# EAGLE design MGC3130_Board (EAGLE 6.3)

## Sheet 1 of 2
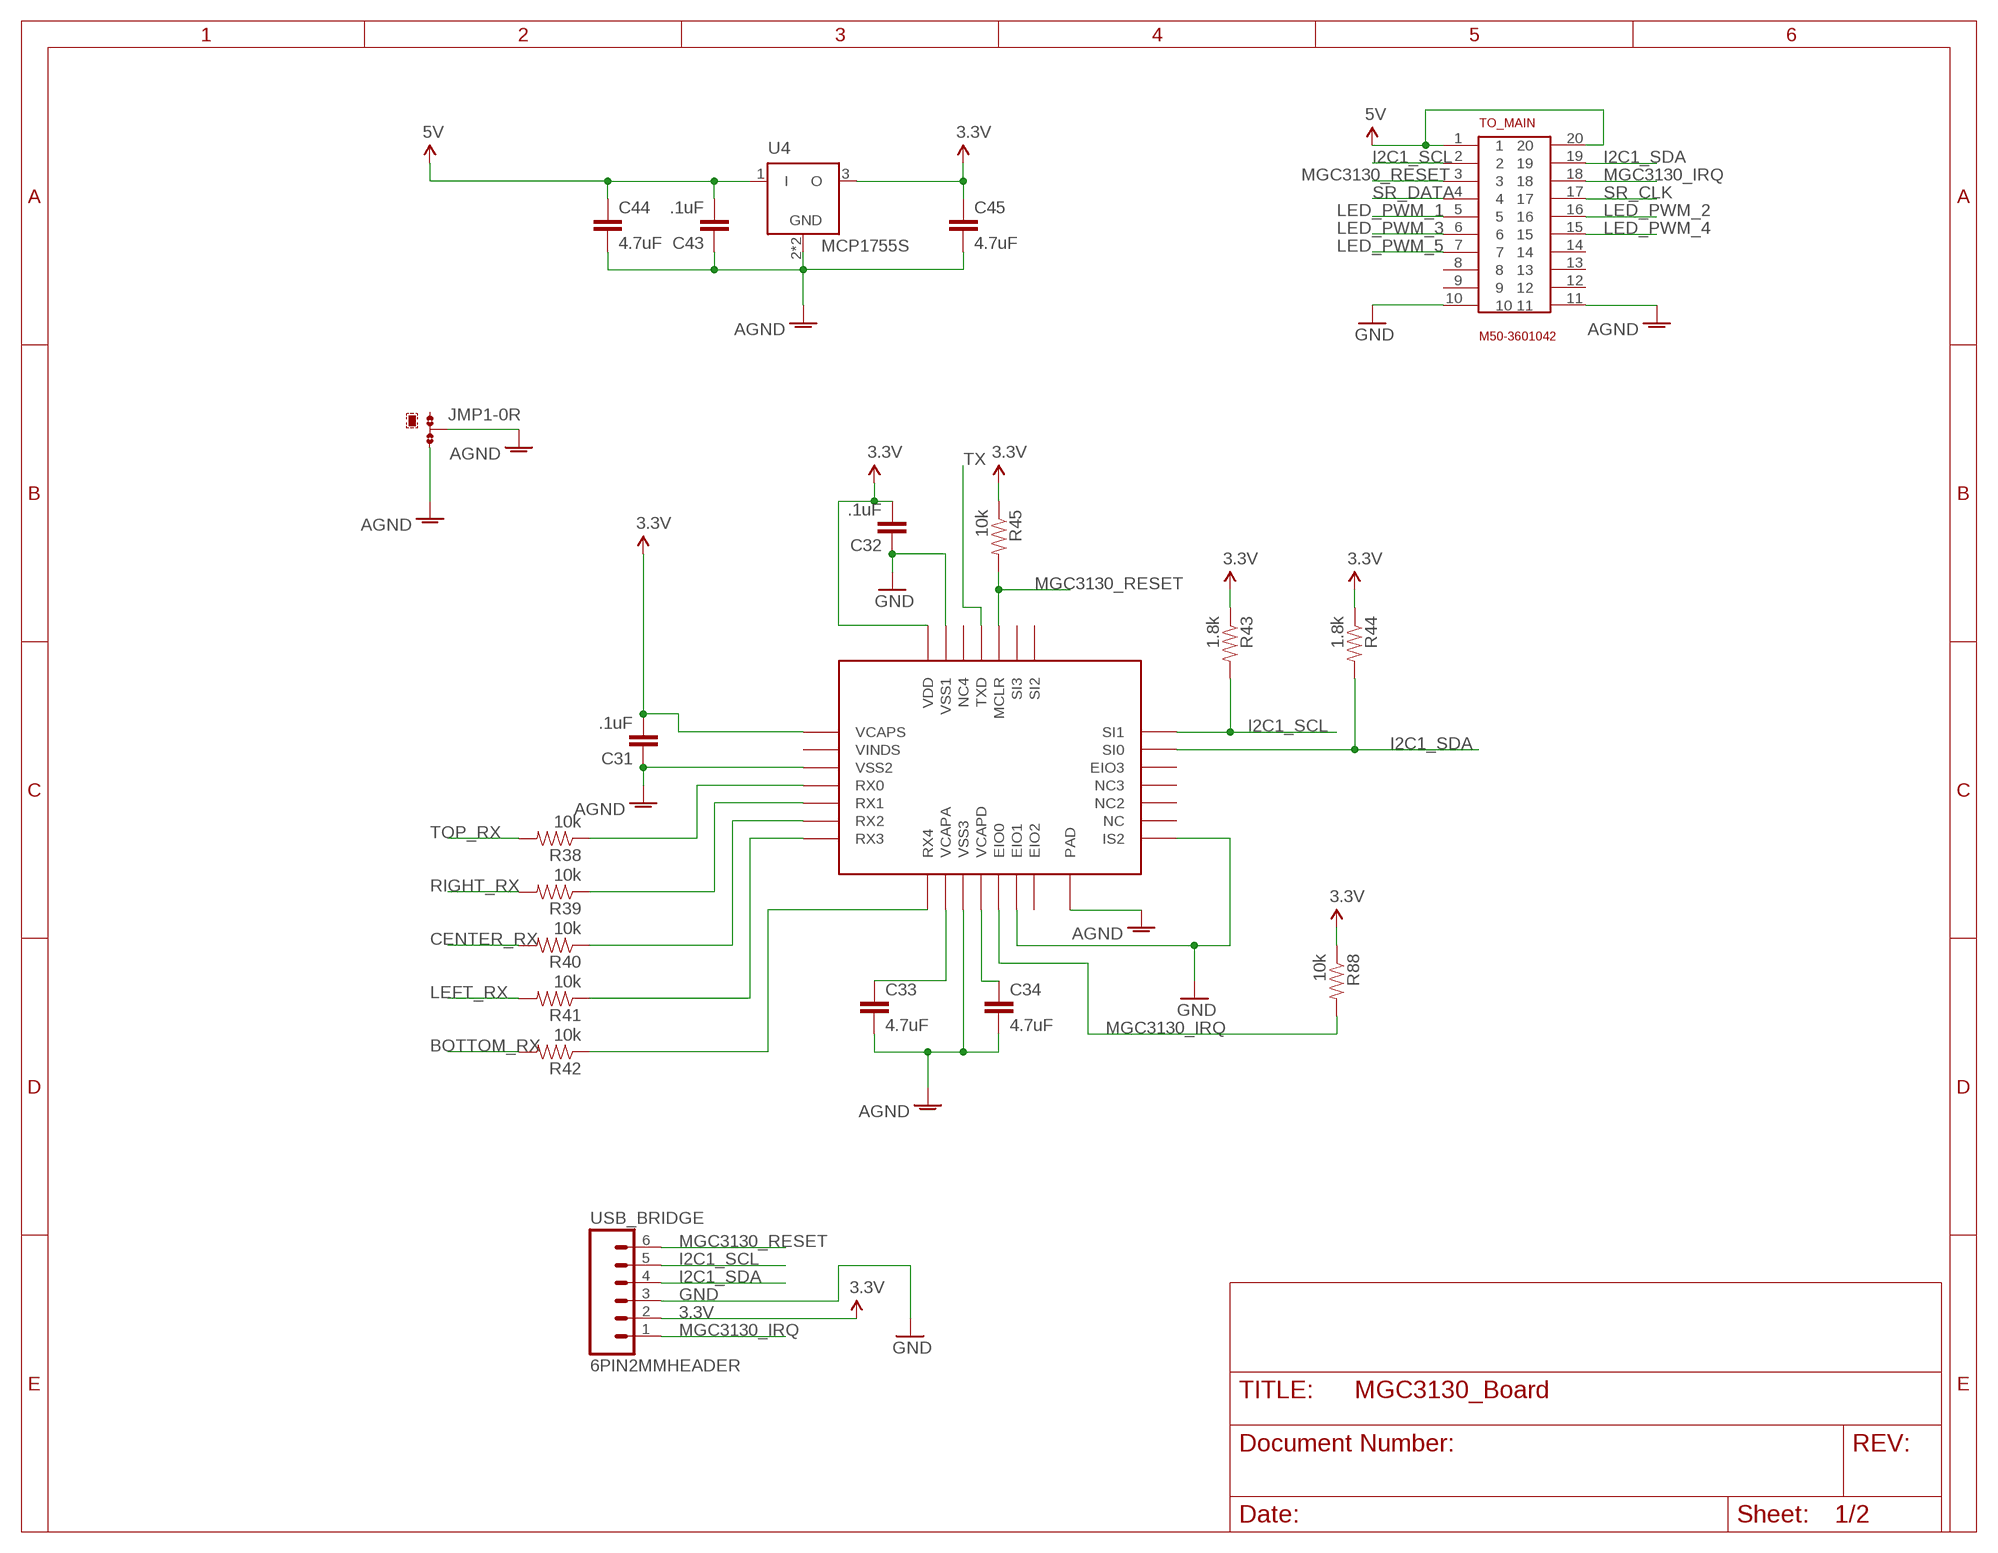
[diagram p0: schematic, sheet 1]

### Parts
C31  .1uF  CAP0603-CAP  [0603-CAP]
C32  .1uF  CAP0603-CAP  [0603-CAP]
C33  4.7uF  CAP1206  [1206]
C34  4.7uF  CAP1206  [1206]
C43  .1uF  CAP0603-CAP  [0603-CAP]
C44  4.7uF  CAP1206  [1206]
C45  4.7uF  CAP1206  [1206]
JMP1  0R-JUMPA  [A0R-JMP]
R38  10k  RESISTOR0603-RES  [0603-RES]
R39  10k  RESISTOR0603-RES  [0603-RES]
R40  10k  RESISTOR0603-RES  [0603-RES]
R41  10k  RESISTOR0603-RES  [0603-RES]
R42  10k  RESISTOR0603-RES  [0603-RES]
R43  1.8k  RESISTOR0603-RES  [0603-RES]
R44  1.8k  RESISTOR0603-RES  [0603-RES]
R45  10k  RESISTOR0603-RES  [0603-RES]
R88  10k  RESISTOR0603-RES  [0603-RES]
TO_MAIN  M50-3601042  [M50-3601042]
U4  MCP1755S  [SOT223]
U14  MGC3130  [QFN28]
USB_BRIDGE  6PIN2MMHEADER  [1X06_SMD_STRAIGHT]

### Nets
3.3V: C31.2 C32.2 C45.1 R43.1 R44.1 R45.1 R88.1 U4.3(O) U14.P$1(VCAPS) U14.P$28(VDD) USB_BRIDGE.2
5V: C43.2 C44.1 TO_MAIN.1 TO_MAIN.20 U4.1(I) ; also sheet 2
AGND: C31.1 C33.2 C34.2 C43.1 C44.2 C45.2 JMP1.2 JMP1.3 TO_MAIN.11 U4.2(GND) U4.4(GND) U14.P$3(VSS2) U14.P$10(VSS3) U14.P$29(PAD)
BOTTOM_RX: R42.2
CENTER_RX: R40.2
GND: C32.1 TO_MAIN.10 U14.P$13(EIO1) U14.P$15(IS2) U14.P$27(VSS1) USB_BRIDGE.3 ; also sheet 2
I2C1_SCL: R43.2 TO_MAIN.2 U14.P$21(SI1) USB_BRIDGE.5
I2C1_SDA: R44.2 TO_MAIN.19 U14.P$20(SI0) USB_BRIDGE.4
LED_PWM_1: TO_MAIN.5 ; also sheet 2
LED_PWM_2: TO_MAIN.16 ; also sheet 2
LED_PWM_3: TO_MAIN.6 ; also sheet 2
LED_PWM_4: TO_MAIN.15 ; also sheet 2
LED_PWM_5: TO_MAIN.7 ; also sheet 2
LEFT_RX: R41.2
MGC3130_IRQ: R88.2 TO_MAIN.18 U14.P$12(EIO0) USB_BRIDGE.1
MGC3130_RESET: R45.2 TO_MAIN.3 U14.P$24(MCLR) USB_BRIDGE.6
N$45: R38.1 U14.P$4(RX0)
N$46: R39.1 U14.P$5(RX1)
N$47: R40.1 U14.P$6(RX2)
N$48: R41.1 U14.P$7(RX3)
N$49: R42.1 U14.P$8(RX4)
N$50: C33.1 U14.P$9(VCAPA)
N$52: C34.1 U14.P$11(VCAPD)
RIGHT_RX: R39.2
SR_CLK: TO_MAIN.17 ; also sheet 2
SR_DATA: TO_MAIN.4 ; also sheet 2
TOP_RX: R38.2
TX: U14.P$25(TXD)
Unconnected: JMP1.1 TO_MAIN.8 TO_MAIN.9 TO_MAIN.12 TO_MAIN.13 TO_MAIN.14 U14.P$2(VINDS) U14.P$14(EIO2) U14.P$16(NC) U14.P$17(NC2) U14.P$18(NC3) U14.P$19(EIO3) U14.P$22(SI2) U14.P$23(SI3) U14.P$26(NC4)

## Sheet 2 of 2
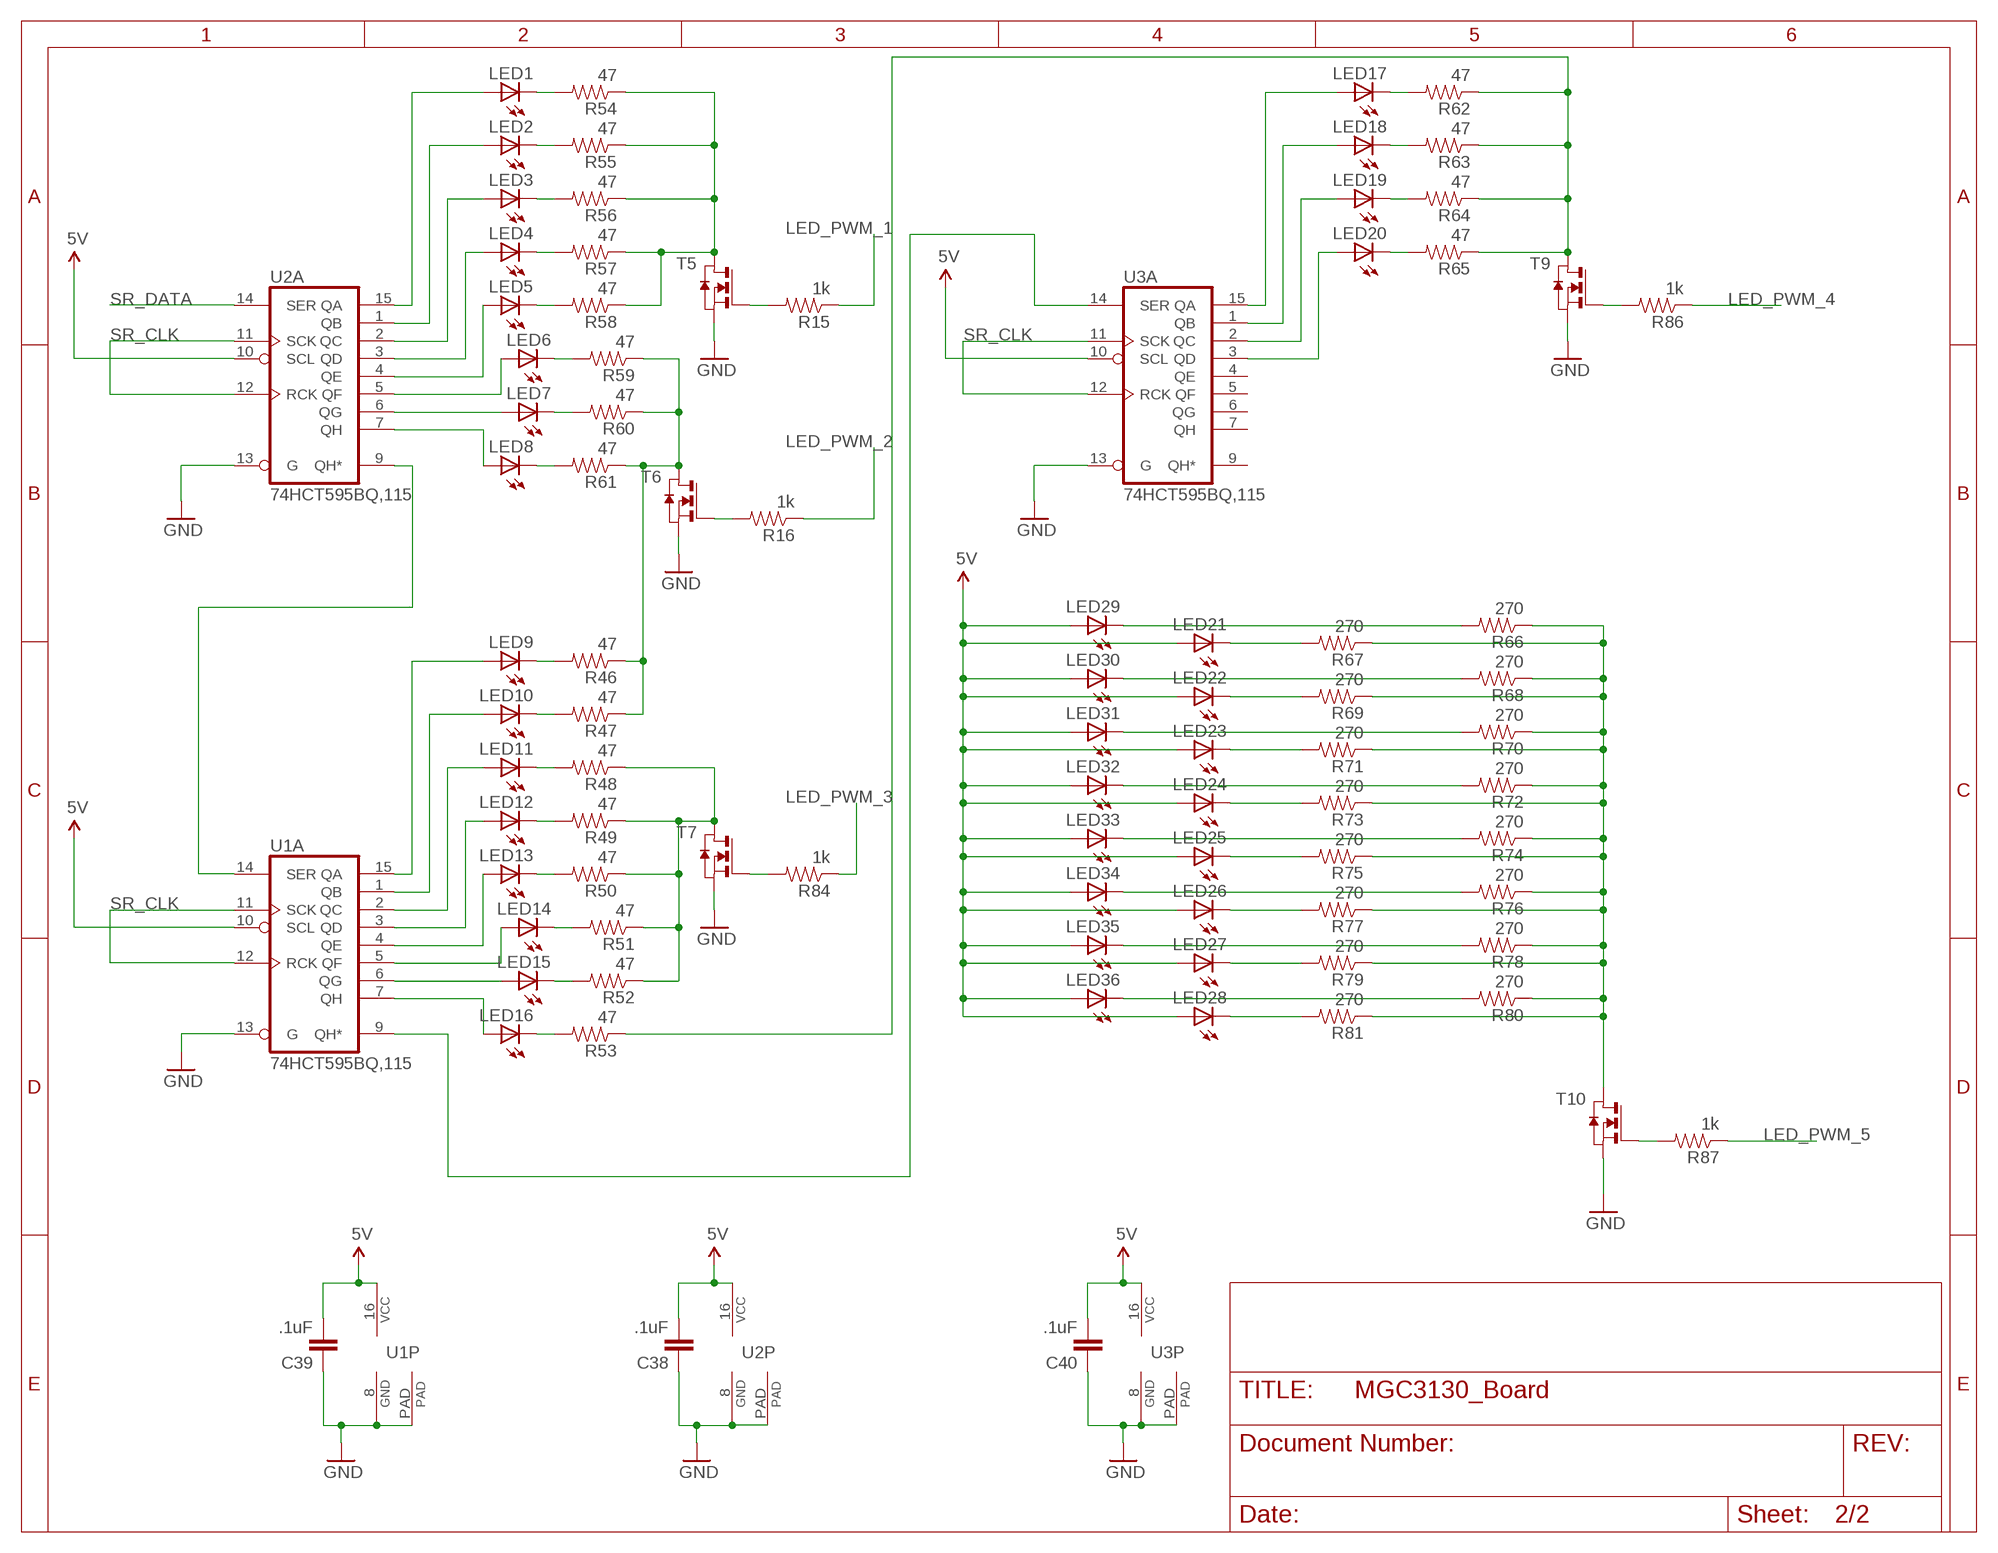
[diagram p1: schematic, sheet 2]

### Parts
C38  .1uF  CAP0603-CAP  [0603-CAP]
C39  .1uF  CAP0603-CAP  [0603-CAP]
C40  .1uF  CAP0603-CAP  [0603-CAP]
LED1  APA3010QBC/D-GX  [APA3010]
LED2  APA3010QBC/D-GX  [APA3010]
LED3  APA3010QBC/D-GX  [APA3010]
LED4  APA3010QBC/D-GX  [APA3010]
LED5  APA3010QBC/D-GX  [APA3010]
LED6  APA3010QBC/D-GX  [APA3010]
LED7  APA3010QBC/D-GX  [APA3010]
LED8  APA3010QBC/D-GX  [APA3010]
LED9  APA3010QBC/D-GX  [APA3010]
LED10  APA3010QBC/D-GX  [APA3010]
LED11  APA3010QBC/D-GX  [APA3010]
LED12  APA3010QBC/D-GX  [APA3010]
LED13  APA3010QBC/D-GX  [APA3010]
LED14  APA3010QBC/D-GX  [APA3010]
LED15  APA3010QBC/D-GX  [APA3010]
LED16  APA3010QBC/D-GX  [APA3010]
LED17  APA3010QBC/D-GX  [APA3010]
LED18  APA3010QBC/D-GX  [APA3010]
LED19  APA3010QBC/D-GX  [APA3010]
LED20  APA3010QBC/D-GX  [APA3010]
LED21  APA3010SRCPRV-GX  [APA3010]
LED22  APA3010SRCPRV-GX  [APA3010]
LED23  APA3010SRCPRV-GX  [APA3010]
LED24  APA3010SRCPRV-GX  [APA3010]
LED25  APA3010SRCPRV-GX  [APA3010]
LED26  APA3010SRCPRV-GX  [APA3010]
LED27  APA3010SRCPRV-GX  [APA3010]
LED28  APA3010SRCPRV-GX  [APA3010]
LED29  APA3010SRCPRV-GX  [APA3010]
LED30  APA3010SRCPRV-GX  [APA3010]
LED31  APA3010SRCPRV-GX  [APA3010]
LED32  APA3010SRCPRV-GX  [APA3010]
LED33  APA3010SRCPRV-GX  [APA3010]
LED34  APA3010SRCPRV-GX  [APA3010]
LED35  APA3010SRCPRV-GX  [APA3010]
LED36  APA3010SRCPRV-GX  [APA3010]
R15  1k  RESISTOR0603-RES  [0603-RES]
R16  1k  RESISTOR0603-RES  [0603-RES]
R46  47  RESISTOR0603-RES  [0603-RES]
R47  47  RESISTOR0603-RES  [0603-RES]
R48  47  RESISTOR0603-RES  [0603-RES]
R49  47  RESISTOR0603-RES  [0603-RES]
R50  47  RESISTOR0603-RES  [0603-RES]
R51  47  RESISTOR0603-RES  [0603-RES]
R52  47  RESISTOR0603-RES  [0603-RES]
R53  47  RESISTOR0603-RES  [0603-RES]
R54  47  RESISTOR0603-RES  [0603-RES]
R55  47  RESISTOR0603-RES  [0603-RES]
R56  47  RESISTOR0603-RES  [0603-RES]
R57  47  RESISTOR0603-RES  [0603-RES]
R58  47  RESISTOR0603-RES  [0603-RES]
R59  47  RESISTOR0603-RES  [0603-RES]
R60  47  RESISTOR0603-RES  [0603-RES]
R61  47  RESISTOR0603-RES  [0603-RES]
R62  47  RESISTOR0603-RES  [0603-RES]
R63  47  RESISTOR0603-RES  [0603-RES]
R64  47  RESISTOR0603-RES  [0603-RES]
R65  47  RESISTOR0603-RES  [0603-RES]
R66  270  RESISTOR0603-RES  [0603-RES]
R67  270  RESISTOR0603-RES  [0603-RES]
R68  270  RESISTOR0603-RES  [0603-RES]
R69  270  RESISTOR0603-RES  [0603-RES]
R70  270  RESISTOR0603-RES  [0603-RES]
R71  270  RESISTOR0603-RES  [0603-RES]
R72  270  RESISTOR0603-RES  [0603-RES]
R73  270  RESISTOR0603-RES  [0603-RES]
R74  270  RESISTOR0603-RES  [0603-RES]
R75  270  RESISTOR0603-RES  [0603-RES]
R76  270  RESISTOR0603-RES  [0603-RES]
R77  270  RESISTOR0603-RES  [0603-RES]
R78  270  RESISTOR0603-RES  [0603-RES]
R79  270  RESISTOR0603-RES  [0603-RES]
R80  270  RESISTOR0603-RES  [0603-RES]
R81  270  RESISTOR0603-RES  [0603-RES]
R84  1k  RESISTOR0603-RES  [0603-RES]
R86  1k  RESISTOR0603-RES  [0603-RES]
R87  1k  RESISTOR0603-RES  [0603-RES]
T5  NMOSSOT23  [SOT-23]
T6  NMOSSOT23  [SOT-23]
T7  NMOSSOT23  [SOT-23]
T9  NMOSSOT23  [SOT-23]
T10  NMOSSOT23  [SOT-23]
U1  74HCT595BQ,115  [DHVQFN16]
U2  74HCT595BQ,115  [DHVQFN16]
U3  74HCT595BQ,115  [DHVQFN16]

### Nets
5V: C38.2 C39.2 C40.2 LED21.P$2(A) LED22.P$2(A) LED23.P$2(A) LED24.P$2(A) LED25.P$2(A) LED26.P$2(A) LED27.P$2(A) LED28.P$2(A) LED29.P$2(A) LED30.P$2(A) LED31.P$2(A) LED32.P$2(A) LED33.P$2(A) LED34.P$2(A) LED35.P$2(A) LED36.P$2(A) U1.10(A:SCL) U1.16(P:VCC) U2.10(A:SCL) U2.16(P:VCC) U3.10(A:SCL) U3.16(P:VCC) ; also sheet 1
GND: C38.1 C39.1 C40.1 T5.2(S) T6.2(S) T7.2(S) T9.2(S) T10.2(S) U1.8(P:GND) U1.13(A:G) U1.PAD(P:GND1) U2.8(P:GND) U2.13(A:G) U2.PAD(P:GND1) U3.8(P:GND) U3.13(A:G) U3.PAD(P:GND1) ; also sheet 1
LED_PWM_1: R15.1 ; also sheet 1
LED_PWM_2: R16.1 ; also sheet 1
LED_PWM_3: R84.1 ; also sheet 1
LED_PWM_4: R86.1 ; also sheet 1
LED_PWM_5: R87.1 ; also sheet 1
N$1: LED29.P$1(C) R66.2
N$2: LED21.P$1(C) R67.2
N$3: LED30.P$1(C) R68.2
N$4: LED22.P$1(C) R69.2
N$5: LED31.P$1(C) R70.2
N$6: LED15.P$2(A) U1.6(A:QG)
N$8: LED23.P$1(C) R71.2
N$9: LED32.P$1(C) R72.2
N$10: LED24.P$1(C) R73.2
N$11: LED34.P$1(C) R76.2
N$12: LED33.P$1(C) R74.2
N$13: LED25.P$1(C) R75.2
N$14: LED26.P$1(C) R77.2
N$15: LED35.P$1(C) R78.2
N$16: LED27.P$1(C) R79.2
N$17: R15.2 T5.3(G)
N$18: LED36.P$1(C) R80.2
N$19: LED28.P$1(C) R81.2
N$51: LED1.P$2(A) U2.15(A:QA)
N$53: LED2.P$2(A) U2.1(A:QB)
N$54: LED3.P$2(A) U2.2(A:QC)
N$55: LED4.P$2(A) U2.3(A:QD)
N$56: LED5.P$2(A) U2.4(A:QE)
N$57: LED6.P$2(A) U2.5(A:QF)
N$58: LED7.P$2(A) U2.6(A:QG)
N$59: LED8.P$2(A) U2.7(A:QH)
N$60: LED1.P$1(C) R54.2
N$61: LED2.P$1(C) R55.2
N$62: LED3.P$1(C) R56.2
N$63: LED4.P$1(C) R57.2
N$64: LED5.P$1(C) R58.2
N$65: LED6.P$1(C) R59.2
N$66: LED7.P$1(C) R60.2
N$67: LED8.P$1(C) R61.2
N$68: R54.1 R55.1 R56.1 R57.1 R58.1 T5.1(D)
N$69: R46.1 R47.1 R59.1 R60.1 R61.1 T6.1(D)
N$70: LED9.P$2(A) U1.15(A:QA)
N$71: LED10.P$2(A) U1.1(A:QB)
N$72: LED11.P$2(A) U1.2(A:QC)
N$73: LED12.P$2(A) U1.3(A:QD)
N$74: LED13.P$2(A) U1.4(A:QE)
N$75: LED14.P$2(A) U1.5(A:QF)
N$77: LED16.P$2(A) U1.7(A:QH)
N$78: LED9.P$1(C) R46.2
N$79: LED10.P$1(C) R47.2
N$80: LED11.P$1(C) R48.2
N$81: LED12.P$1(C) R49.2
N$82: LED13.P$1(C) R50.2
N$83: LED14.P$1(C) R51.2
N$84: LED15.P$1(C) R52.2
N$85: LED16.P$1(C) R53.2
N$87: R48.1 R49.1 R50.1 R51.1 R52.1 T7.1(D)
N$88: LED17.P$2(A) U3.15(A:QA)
N$89: LED18.P$2(A) U3.1(A:QB)
N$90: LED19.P$2(A) U3.2(A:QC)
N$91: LED20.P$2(A) U3.3(A:QD)
N$92: R66.1 R67.1 R68.1 R69.1 R70.1 R71.1 R72.1 R73.1 R74.1 R75.1 R76.1 R77.1 R78.1 R79.1 R80.1 R81.1 T10.1(D)
N$93: U1.14(A:SER) U2.9(A:QH*)
N$96: LED17.P$1(C) R62.2
N$97: LED18.P$1(C) R63.2
N$98: LED19.P$1(C) R64.2
N$99: LED20.P$1(C) R65.2
N$104: R53.1 R62.1 R63.1 R64.1 R65.1 T9.1(D)
N$115: U1.9(A:QH*) U3.14(A:SER)
N$118: R16.2 T6.3(G)
N$120: R84.2 T7.3(G)
N$121: R86.2 T9.3(G)
N$122: R87.2 T10.3(G)
SR_CLK: U1.11(A:SCK) U1.12(A:RCK) U2.11(A:SCK) U2.12(A:RCK) U3.11(A:SCK) U3.12(A:RCK) ; also sheet 1
SR_DATA: U2.14(A:SER) ; also sheet 1
Unconnected: U3.4(A:QE) U3.5(A:QF) U3.6(A:QG) U3.7(A:QH) U3.9(A:QH*)

## Library data of the parts
C31 C32 C38-C40 C43 = SparkFun-Passives:CAP: Capacitor Standard 0603 ceramic capacitor, and 0.1" leaded capacitor.
C33 C34 C44 C45 = SparkFun-Capacitors:CAP: Capacitor Standard 0603 ceramic capacitor, and 0.1" leaded capacitor.
JMP1 = jump-0r-smd:0R-JUMP: SMD 0R 0805 Jumper
LED1-LED20 = HackMe:APA3010QBC/D-GX
LED21-LED36 = HackMe:APA3010SRCPRV-GX: Kingbright Right Angle Red SMT LED
R15 R16 R38-R81 R84 R86-R88 = SparkFun-Passives:RESISTOR: Resistor Basic schematic elements and footprints for 0603, 1206, and PTH resistors.
T5-T7 T9 T10 = zetex:NMOSSOT23: MOS FET; OC_FARNELL: unknown; OC_NEWARK: unknown
TO_MAIN = HackMe:M50-3601042
U1-U3 = HackMe:74HCT595BQ,115: Shift Register DHVQFN16
U4 = HackMe:MCP1755S
U14 = HackMe:MGC3130
USB_BRIDGE = HackMe:6PIN2MMHEADER

## Board
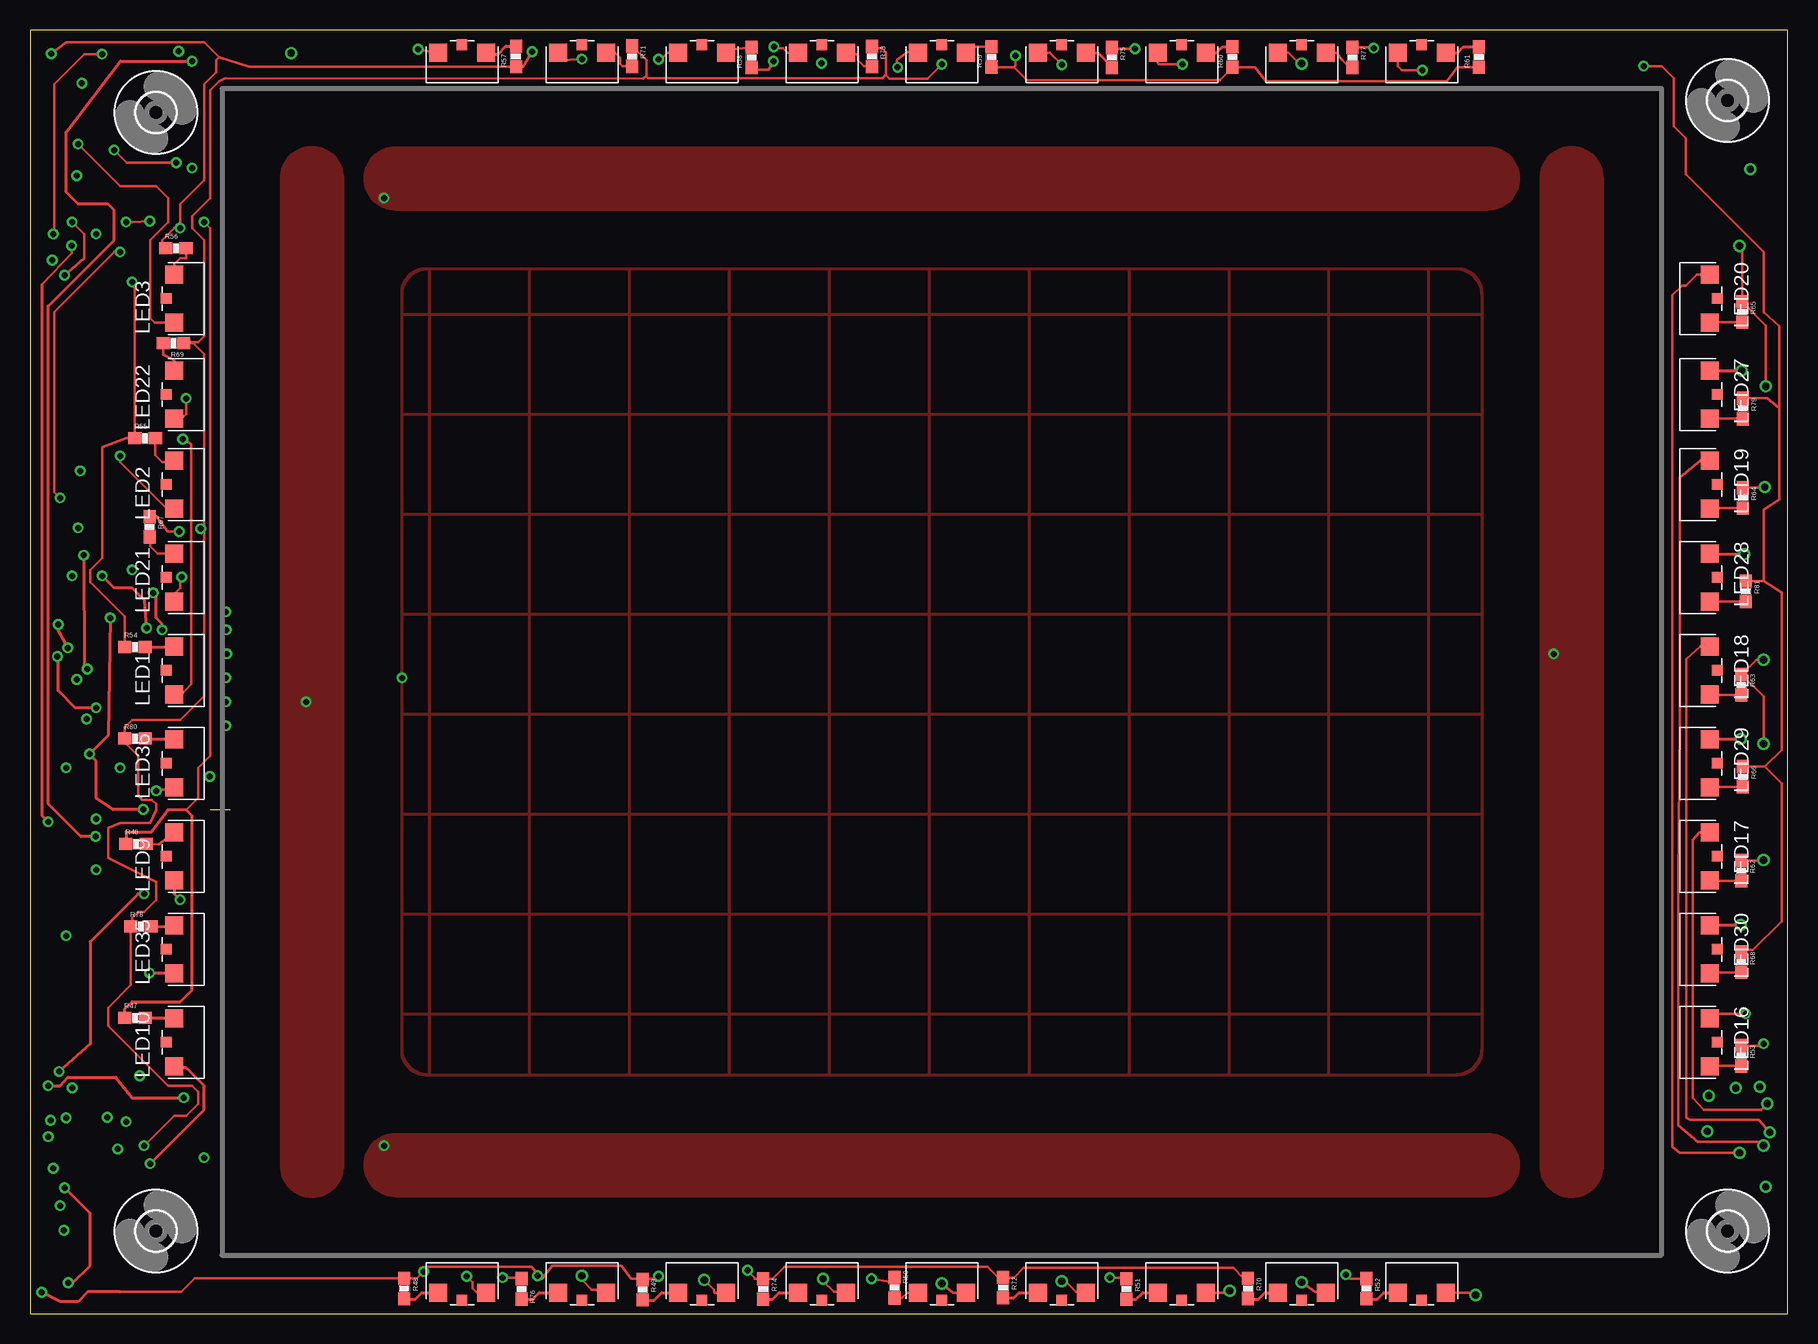
[diagram p2: board, top side]
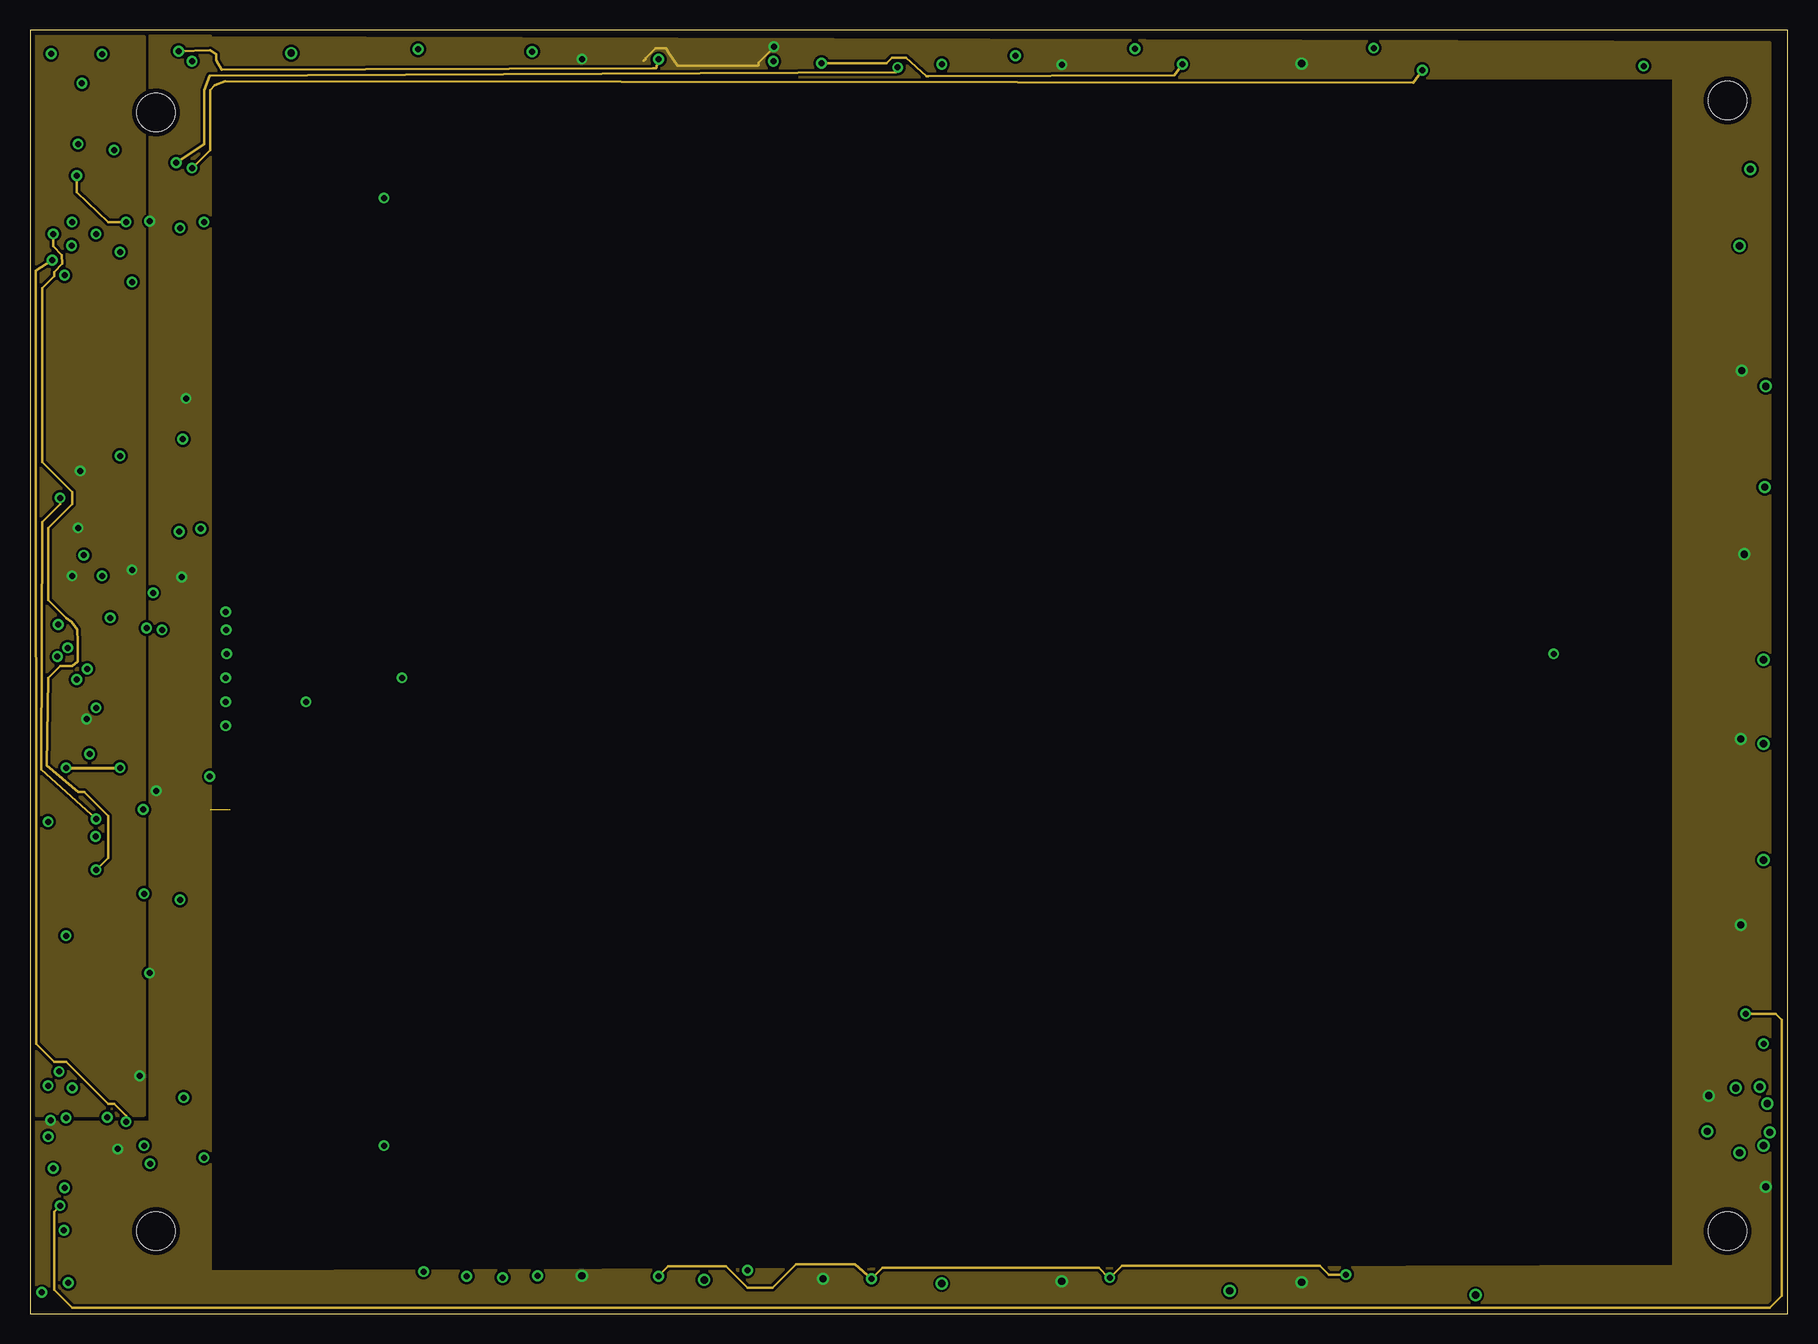
[diagram p3: board, inner layer Route2]
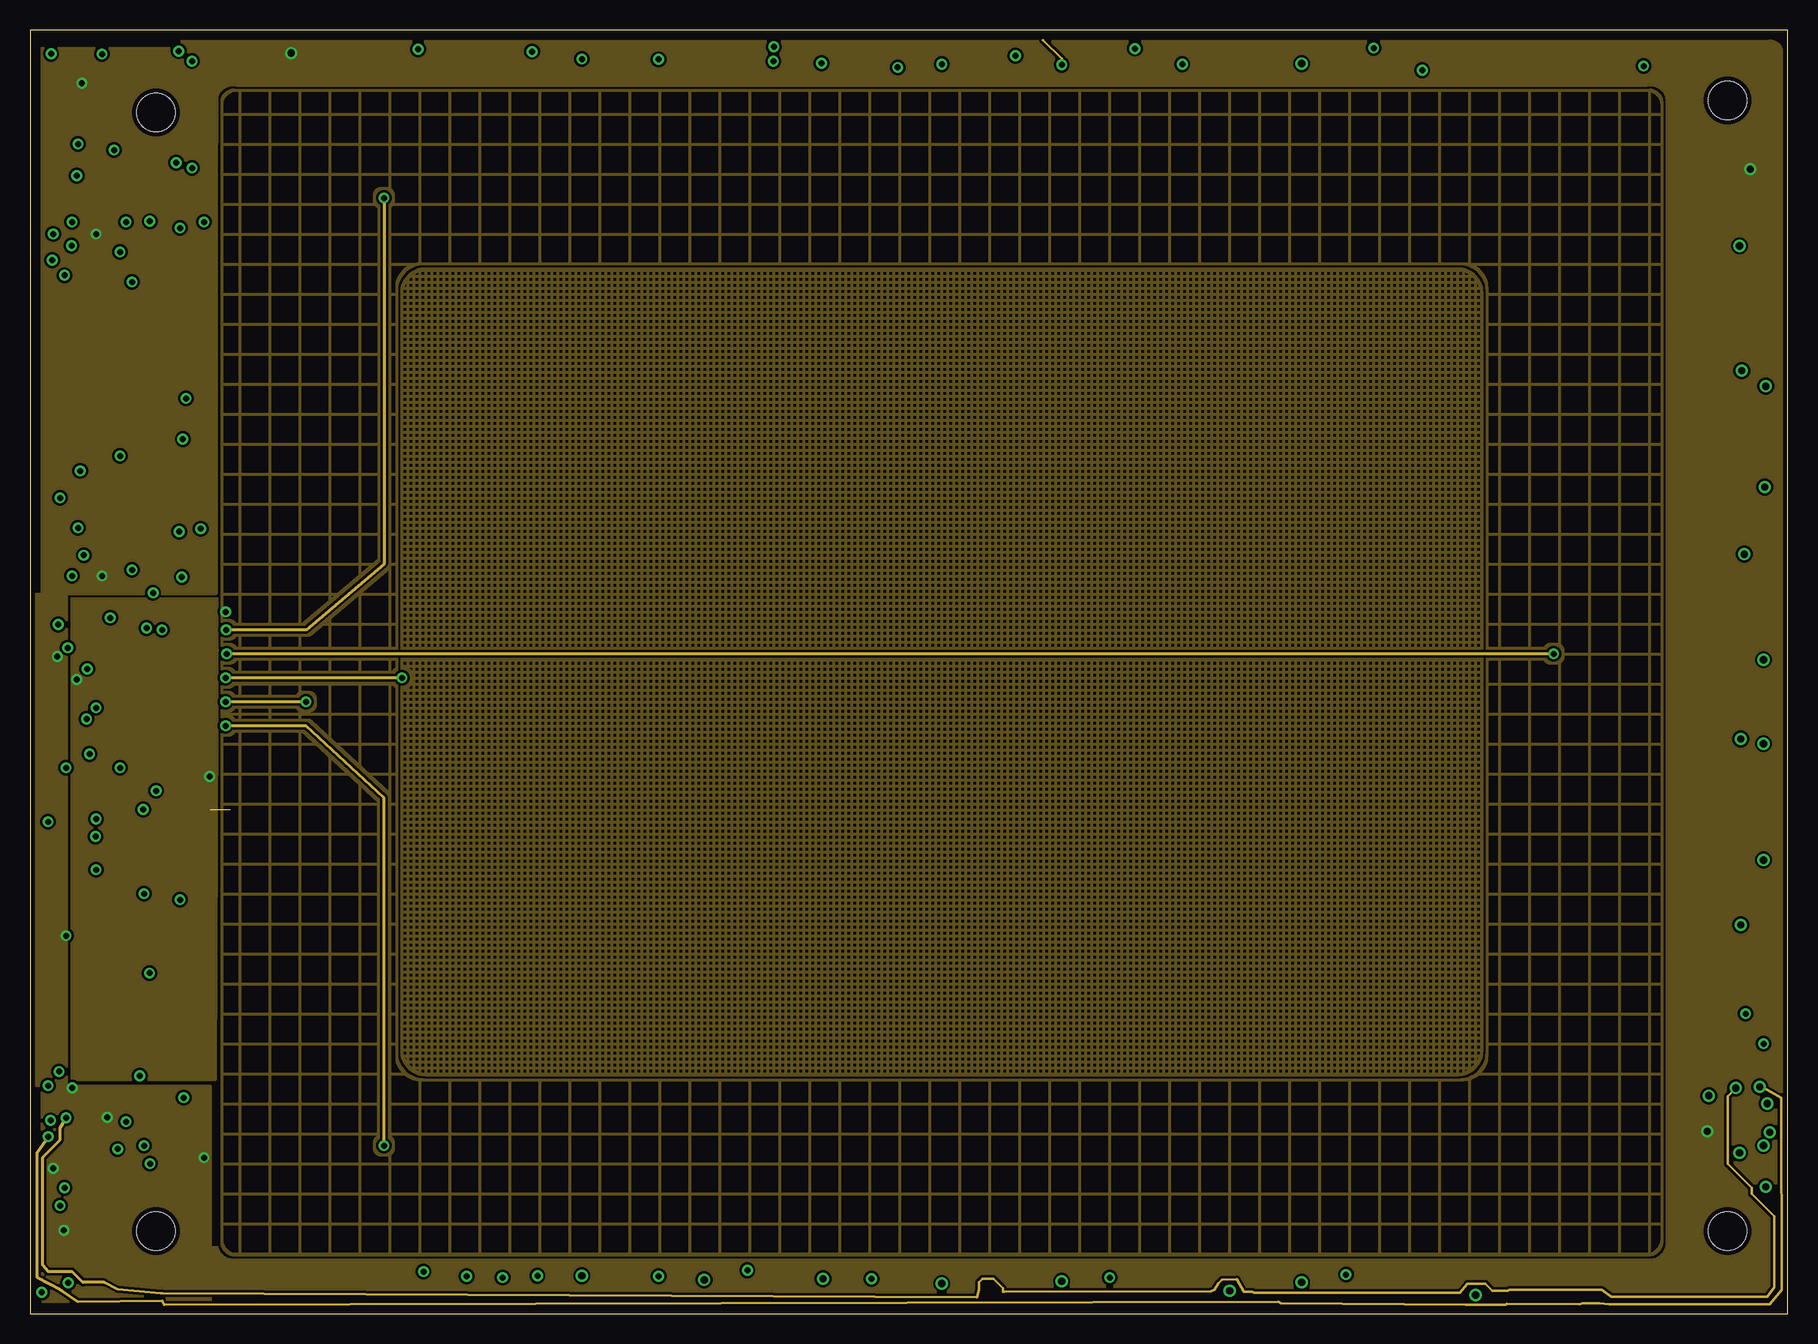
[diagram p4: board, inner layer Route15]
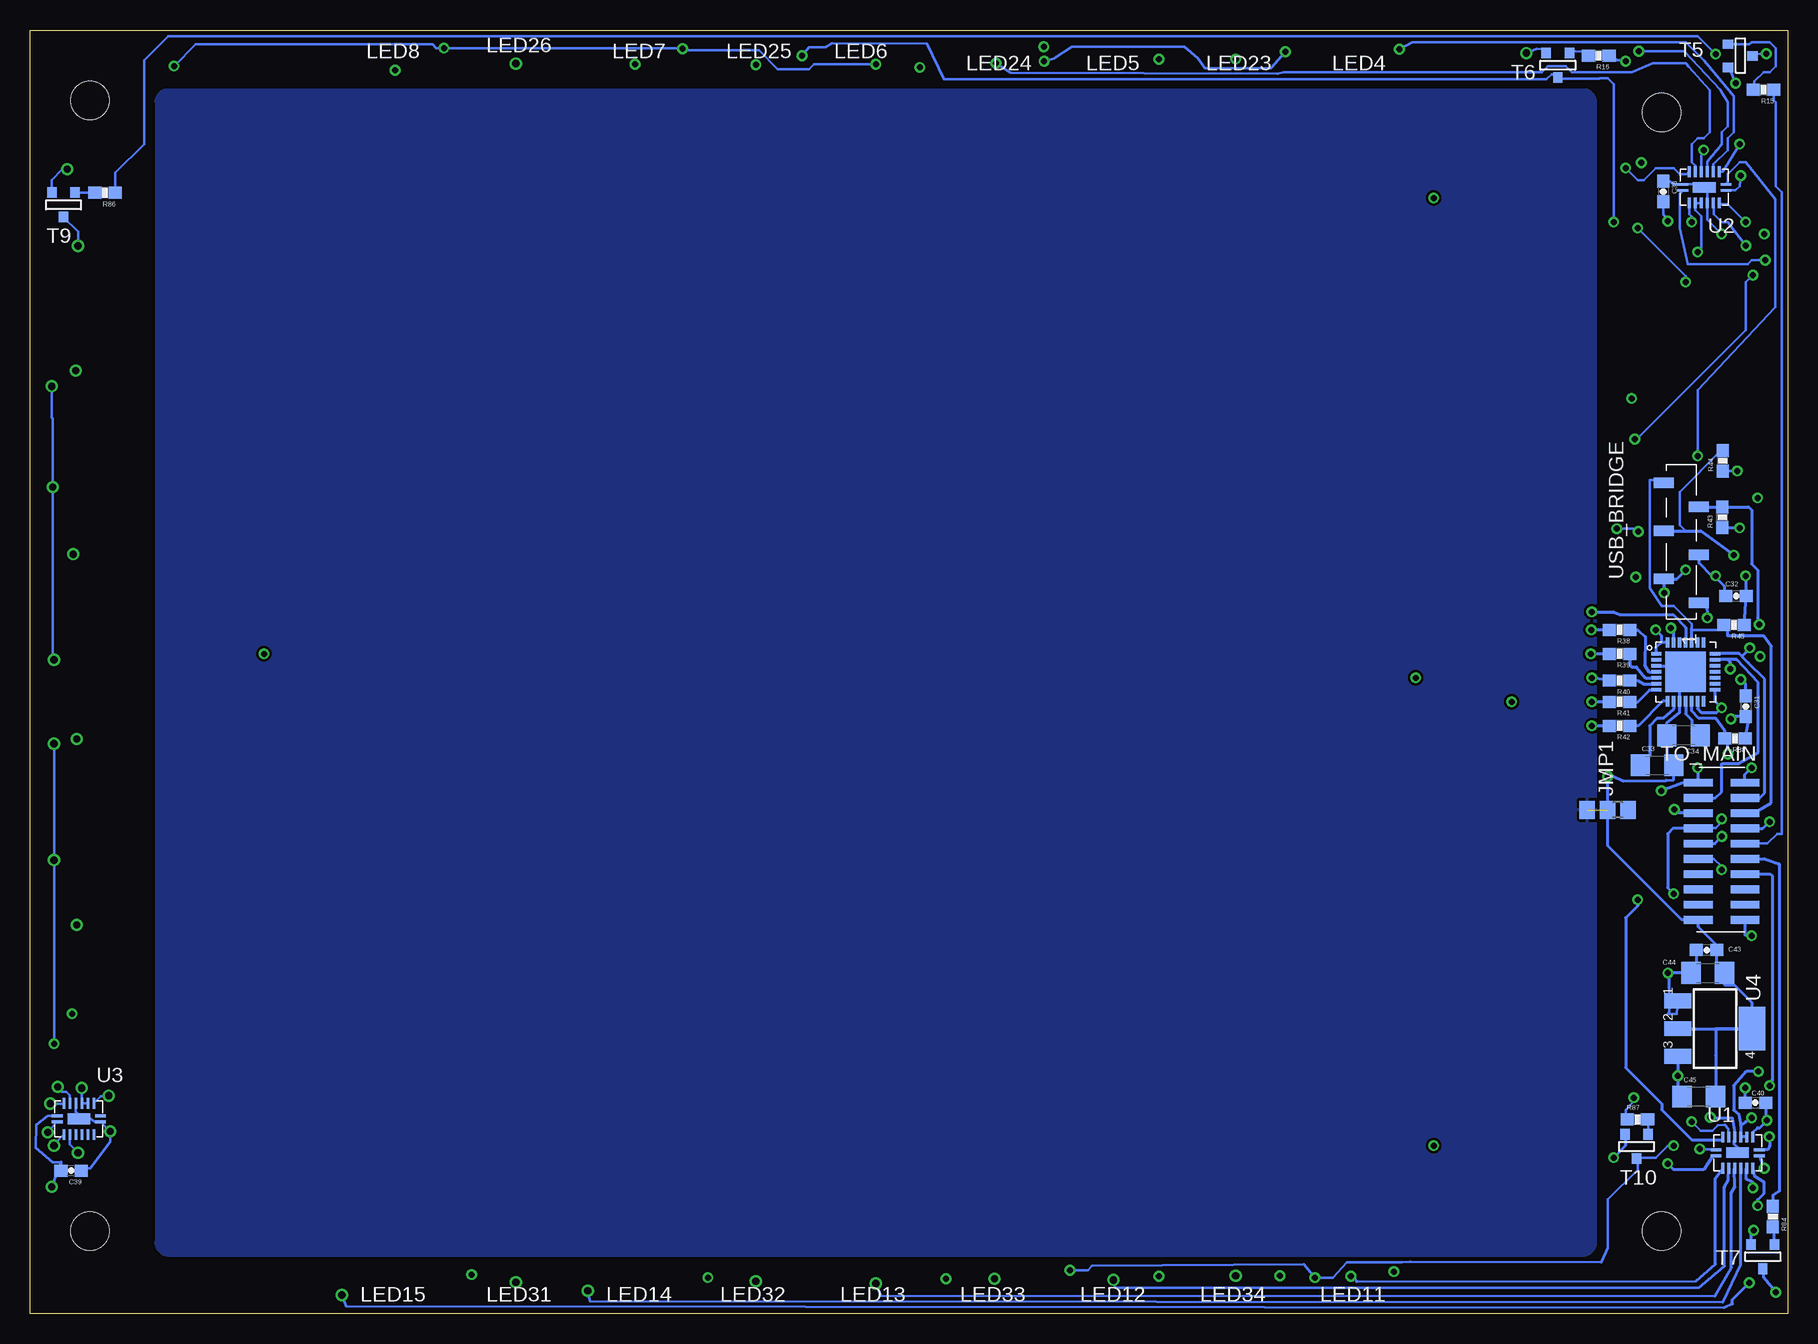
[diagram p5: board, bottom side, seen from below]

Size 146.5 x 107 mm. Coordinates in mm from the lower left corner, seen from the top.
Outline: 0,0 146.5,0 146.5,107 0,107 0,0
Copper layers (1*2+15*16): Top 0.035mm / dielectric 1.5mm / Route2 0.035mm / dielectric 0.15mm / Route15 0.035mm / dielectric 0.2mm / Bottom 0.035mm
Design rules "default *": minimum track width 8mil, minimum drill 12mil, track to track 8mil, track to pad 8mil, pad to pad 8mil, via to via 8mil, smd to smd 8mil, copper to edge 15mil, drill to drill 8mil, minimum pad ring 10mil, minimum via ring 8mil, stop-mask expansion 4mil, vias tented up to drill 0mil, thermal gap 10mil

### Footprints (pad centres in the part's own frame; a part is rotated, then mirrored left to right if it is on the bottom)
0603-CAP = smd 1.1 x 1: 1 -0.85,0; 2 0.85,0
1206 = smd 1.6 x 1.8: 1 -1.4,0; 2 1.4,0
A0R-JMP = smd 1.5 x 1.3: 1 0,1.7; 2 0,0; 3 0,-1.7
APA3010 = smd 1.5 x 1.5: P$1 2,0; P$2 -2,0 | smd 0.9 x 0.9: P$3 0,0.65
0603-RES = smd 1.1 x 1: 1 -0.85,0; 2 0.85,0
SOT-23 = smd 0.787 x 0.889: 1 0.025,-1.016; 2 -0.94,1.016; 3 0.991,1.016
M50-3601042 = smd 0.65 x 2.4 bottom: 1 0,-1.95; 2 1.27,-1.95; 3 2.54,-1.95; 4 3.81,-1.95; 5 5.08,-1.95; 6 6.35,-1.95; 7 7.62,-1.95; 8 8.89,-1.95; 9 10.16,-1.95; 10 11.43,-1.95; 11 11.43,1.95; 12 10.16,1.95; 13 8.89,1.95; 14 7.62,1.95; 15 6.35,1.95; 16 5.08,1.95; 17 3.81,1.95; 18 2.54,1.95; 19 1.27,1.95; 20 0,1.95
DHVQFN16 = smd 0.9 x 0.24: 1 -1.8,-0.25; 8 1.8,-0.25; 9 1.8,0.25; 16 -1.8,0.25 | smd 0.24 x 0.9: 2 -1.25,-1.3; 3 -0.75,-1.3; 4 -0.25,-1.3; 5 0.25,-1.3; 6 0.75,-1.3; 7 1.25,-1.3; 10 1.25,1.3; 11 0.75,1.3; 12 0.25,1.3; 13 -0.25,1.3; 14 -0.75,1.3; 15 -1.25,1.3 | smd 1.9 x 0.9: PAD 0,0
SOT223 = smd 1.219 x 2.235: 1 -2.311,-3.099; 2 0,-3.099; 3 2.311,-3.099 | smd 3.6 x 2.2: 4 0,3.099
QFN28 = smd 0.85 x 0.3: P$1 -2.45,1.5; P$2 -2.45,1; P$3 -2.45,0.5; P$4 -2.45,0; P$5 -2.45,-0.5; P$6 -2.45,-1; P$7 -2.45,-1.5; P$15 2.45,-1.5; P$16 2.45,-1; P$17 2.45,-0.5; P$18 2.45,0; P$19 2.45,0.5; P$20 2.45,1; P$21 2.45,1.5 | smd 0.3 x 0.85: P$8 -1.5,-2.45; P$9 -1,-2.45; P$10 -0.5,-2.45; P$11 0,-2.45; P$12 0.5,-2.45; P$13 1,-2.45; P$14 1.5,-2.45; P$22 1.5,2.45; P$23 1,2.45; P$24 0.5,2.45; P$25 0,2.45; P$26 -0.5,2.45; P$27 -1,2.45; P$28 -1.5,2.45 | smd 3.35 x 3.35: P$29 0,0
3,2 = hole 3.2: 0,0
1X06_SMD_STRAIGHT = smd 0.89 x 1.67: 1 0,1.465; 2 -2,-1.465; 3 -4,1.465; 4 -6,-1.465; 5 -8,1.465; 6 -10,-1.465

### Placement (x,y rotation side)
C31  3.48,50.62 270 bottom
C32  4.29,59.82 0 bottom
C33  10.88,45.71 0 bottom
C34  8.66,48.19 180 bottom
C38  10.36,93.54 270 bottom
C39  143.07,11.91 180 bottom
C40  2.67,17.58 0 bottom
C43  6.75,30.3 180 bottom
C44  6.65,28.4 0 bottom
C45  7.4,18.1 0 bottom
JMP1  15,42 270 bottom
LED1  12,53.62 90 top
LED2  12,69.12 90 top
LED3  12,84.62 90 top
LED4  36,105.12 0 top
LED5  56,105.12 0 top
LED6  76,105.12 0 top
LED7  96,105.12 0 top
LED8  116,105.12 0 top
LED9  12,38.12 90 top
LED10  12,22.62 90 top
LED11  36,1.75 180 top
LED12  56,1.75 180 top
LED13  76,1.75 180 top
LED14  96,1.75 180 top
LED15  116,1.75 180 top
LED16  140,22.62 270 top
LED17  140,38.12 270 top
LED18  140,53.62 270 top
LED19  140,69.12 270 top
LED20  140,84.62 270 top
LED21  12,61.38 90 top
LED22  12,76.62 90 top
LED23  46,105.12 0 top
LED24  66,105.12 0 top
LED25  86,105.12 0 top
LED26  106,105.12 0 top
LED27  140,76.62 270 top
LED28  140,61.38 270 top
LED29  140,45.88 270 top
LED30  140,30.38 270 top
LED31  106,1.75 180 top
LED32  86,1.75 180 top
LED33  66,1.75 180 top
LED34  46,1.75 180 top
LED35  12,30.38 90 top
LED36  12,45.88 90 top
R15  2,102.01 180 bottom
R16  15.73,104.86 180 bottom
R38  14,57 180 bottom
R39  14,55 180 bottom
R40  14,52.76 180 bottom
R41  14,51 180 bottom
R42  14,49 180 bottom
R43  5.45,66.38 90 bottom
R44  5.4,71.09 90 bottom
R45  4.46,57.4 180 bottom
R46  8.84,39.15 0 top
R47  8.75,24.65 0 top
R48  31.2,2.08 270 top
R49  51.05,1.99 270 top
R50  72.05,2.15 270 top
R51  91.4,2.04 270 top
R52  111.4,2.07 270 top
R53  142.65,21.48 270 top
R54  8.75,55.56 0 top
R55  9.6,72.96 0 top
R56  12.15,88.8 0 top
R57  40.5,104.8 90 top
R58  60.14,104.72 90 top
R59  80.14,104.76 90 top
R60  100.24,104.75 90 top
R61  120.79,104.74 90 top
R62  142.66,36.92 270 top
R63  142.66,52.43 270 top
R64  142.76,67.99 270 top
R65  142.71,83.5 270 top
R66  142.76,44.76 270 top
R67  9.96,65.6 270 top
R68  142.66,29.28 270 top
R69  11.95,80.88 180 top
R70  101.52,2.1 270 top
R71  50.17,104.81 270 top
R72  81.12,2.17 270 top
R73  70.17,104.78 270 top
R74  61.12,2.04 270 top
R75  90.17,104.7 270 top
R76  40.97,2.06 270 top
R77  110.22,104.72 270 top
R78  9.25,32.27 0 top
R79  142.77,75.44 270 top
R80  8.75,47.92 0 top
R81  143.02,60.21 270 top
R84  1.21,8.08 270 bottom
R86  140.24,93.42 180 bottom
R87  12.51,16.17 0 bottom
R88  4.38,47.93 180 bottom
T5  3.93,104.82 90 bottom
T6  19.17,104.06 0 bottom
T7  2.09,4.74 0 bottom
T9  143.74,92.43 0 bottom
T10  12.6,13.92 0 bottom
TO_MAIN  5.5,44.25 270 top
U1  4.16,13.41 0 bottom
U2  6.93,93.88 180 bottom
U3  142.42,16.22 0 bottom
U4  6.05,23.75 270 bottom
U14  8.5,53.5 0 bottom
U$1  [3,2]  10.5,100.12 0 top
U$2  [3,2]  141.5,101.12 0 top
U$3  [3,2]  141.5,6.88 0 top
U$4  [3,2]  10.5,6.88 0 top
USB_BRIDGE  8.85,59.25 270 bottom

### Tracks (layer width: path | path; a pad name or v marks a point on that pad's centre or on a via)
3.3V  (via drill 0.5)
  Top 0.254: v11,57 11,57.5 10.5,58 10.5,59.84 v10.26,60.08
  Bottom 0.203: v9.14,19.82 9.14,19.51 9.15,19.5 | R44.1 4.21,70.24 v4.19,70.26 | v4.19,70.25 v4.19,70.26 | v4.19,70.26 4.18,70.27
  Bottom 0.254: R88.1 3.21,49.5 C31.2 4.5,49.77 v4.71,49.56 | U14.P$1 10.95,55.55 10.5,56 | 10.5,56 10.05,56 U14.P$28 | R43.1 4.03,65.53 v4,65.5 | v3.5,61.5 3.44,61.44 C32.2 R45.1 | v8.5,62 9.25,61.25 USB_BRIDGE.2 10.26,61.2 v10.26,60.08 | 10.5,56 10.5,56.5 v11,57 | 9.15,19.12 9.15,17.95 C45.1 | U4.3 9.15,19.5 9.15,19.12 | 9.15,19.12 9.14,19.11
  pour Route2: 0.5,106.5 9.5,106.5 9.5,16.5 0.5,16.5
5V  (via drill 0.5, 0.6)
  Top 0.203: 64.03,105.1 LED24.P$2 63.12,105.12 62.75,105.5 62.25,105.5 v62,105.59 | LED26.P$2 104.03,105.1 104.9,105.1 105.8,104.2 v106,104.2 | LED34.P$2 47.75,2 46.8,2 46,2.8 v46,3.15 | 68.1,1.85 68.05,1.8 67,1.8 66.1,2.7 v66.1,2.9 | LED32.P$2 87.95,1.8 87.2,1.8 86.3,2.7 v86,2.7 | LED31.P$2 107.95,1.8 107.1,1.8 v106,2.6 | 44,105.4 LED23.P$2 44,104.5 v46,104.58 | v9.99,91.05 8.5,91 v8,91 | LED22.P$2 12.62,74.62 13,75 v13,76.29 v12.99,76.3 | LED21.P$2 12,60 12.5,60.5 12.5,61.23 v12.66,61.39 | LED25.P$2 84.03,105.1 85,105.1 v86,104.1 84.97,105.12 LED25.P$2
  Top 0.254: LED27.P$2 140.03,78.6 v142.7,78.6 | LED28.P$2 140.07,63.3 v142.9,63.3 | LED29.P$2 140.03,47.9 v142.6,47.9 | LED30.P$2 140.03,32.4 v142.6,32.4 | LED33.P$2 68.1,1.85 | v10.51,43.58 11.3,43.71 11.96,43.27 LED36.P$2 | v9.96,28.38 LED35.P$2
  Route2 0.203: v62,105.59 62,105.57 60.71,104.28 60.71,104.06 60.66,104.01 53.99,104.01 53.22,105.09 53,105.5 52.15,105.5 51.3,104.65 51.3,104.57 51.15,104.42 | v3.9,94.85 3.9,93.46 6.5,91 v8,91
  Route2 0.254: v3,45.5 v7.5,45.5
  Route15 0.203: v86,104.1 86,104.6 84.45,106.15
  Bottom 0.203: v144.7,10.57 143.9,12.64 C39.2 143.98,12.6 144.6,12.6 146.01,13.8 145.98,15.73 145.03,16.47 U3.16 | U3.10 140.59,18.1 v139.93,18.16 | 9.86,27.12 9.86,25.14 10,25 9.21,25 U4.1 | C38.2 10.36,91.64 v9.99,91.05 | v8,91 8,91.45 8.18,91.63 U2.10 | U2.16 4.37,93.63 4,94 v3.9,94.85
  Bottom 0.254: 9.85,28.4 C44.1 7.6,27.85 C43.2 | 9.85,28.4 9.91,28.48 9.92,28.39 v9.96,28.38 | 9.86,27.12 9.85,28.4 | v10.51,43.58 8.75,44.25 TO_MAIN.20 7.5,44.3 v7.5,45.5 | TO_MAIN.1 3.55,44.95 v3,45.5 | C40.2 1.82,16.18 1.76,16.1 v1.71,16.09 2.3,15.5 2.5,15.5 2.91,15.09 U1.10 | U1.16 7.33,13.67 | 7.33,13.67 7.35,13.65 | 7.33,13.67 7.33,13.68 v7.3,13.71
  pour Route2: 10,106.56 15,106.56 15,3 10,1.5
  pour Route2: 15,106.4 145,106 145,0 3,0.5 3,3.5 137,4 137,103 15,103
  pour Route2: 0.5,16 10,16 10,0.5 0.5,0.5
AGND  (via drill 0.5)  (1 unrouted)
  Bottom 0.203: C33.2 9.48,45.98 9.5,46 | 15,44.81 v15,44.78 v14.99,44.77
  Bottom 0.254: 10.6,48.2 C34.2 | C34.2 10.08,49.05 10.07,49.21 9.44,49.75 8.99,50.1 U14.P$10 9,53 | 9,53 U14.P$29 | U4.4 2.95,25.91 4.4,27.36 5.21,27.36 C44.2 5.25,28.05 5.89,28.69 5.89,29.29 C43.1 5.9,30.7 7.43,32.23 7.43,32.8 TO_MAIN.11 8.82,32.82 15,39 JMP1.2 15,44.8 14.99,44.81 v14.99,44.77 | U14.P$3 10,54 9,53 | C31.1 3.48,52.48 v3.9,52.86 | C34.2 10.06,46.29 C33.2 | 15,44.81 14.55,44.81 13.69,44.4 10.12,44.44 9.5,44.5 9.5,46 | U4.2 U4.4 | U4.4 5.99,23.74 6,21.5 C45.2
  pour Bottom: 17,102 135,102 arc-90 136,101 136,6 arc-90 135,4.88 17,4.88 arc-90 16,6 16,101 arc-90
  pour Route15 (rank 5): 3.5,60 15.6,60.04 15.44,19.5 3.5,19.5
BOTTOM_RX  (via drill 0.5)
  Route15 0.254: v29.5,14 29.5,43 23,49 v16.3,49
  Bottom 0.254: R42.2 v16.3,49
  pour Top: 30.5,14.88 121.5,14.88 arc-180 121.5,9.88 30.5,9.88 arc-180
CENTER_RX  (via drill 0.5)
  Route15 0.254: v31,53 v16.3,53
  Bottom 0.254: R40.2 v16.3,53
  pour Top (hatched): 33,87.12 119,87.12 arc-90 121,85.12 121,21.88 arc-90 119,19.88 33,19.88 arc-90 31,21.88 31,85.12 arc-90
GND  (via drill 0.5, 0.6)
  Top 0.203: 2.37,54.45 2.33,54.49 v2.29,54.76
  Top 0.254: v9.71,57.14 9.56,59.44 8.5,60.5 7,60.5 v6,61.5 | v5.5,50.5 3.76,50.5 2.34,51.92 2.34,54.1 2.37,54.45
  Bottom 0.203: T6.2 20.16,105.35 20.9,105.45 v21.76,105.08 | C39.1 142.16,12.1 141.5,12.1 139.8,14.3 v139.8,15.2 139.85,15.2 U3.8 141.1,15.97 141.42,16.22 U3.PAD 142.42,16.52 142.7,16.8 142.7,17.49 U3.13 | T9.2 144.7,93.47 144.7,94.5 143.8,95.4 v143.4,95.4 | 6.01,16.28 6.36,16.28 v6.44,16.36 | v5.5,90 6.68,91.18 U2.13 6.68,93.63 U2.PAD 7.18,94.13 U2.8 9.54,94.13 9.8,94.39 C38.1 | T5.2 4.88,103.88 v4.33,102.57
  Bottom 0.254: U14.P$13 7.5,50.42 7.18,50.1 5.9,50.1 v5.5,50.5 6.05,51.05 U14.P$15 | TO_MAIN.10 3.55,31.55 v3,31.5 | C40.1 3.51,18.56 v3.52,18.82 | U14.P$27 9.5,57.01 v9.71,57.14 | C32.1 5.27,59.95 5.27,60.64 6,61.37 v6,61.5 6.31,61.5 7.37,62.56 7.37,63.23 USB_BRIDGE.3 | 6.01,16.28 4.58,16.28 4.41,15.26 U1.13 4.42,14.1 4.18,13.86 U1.PAD | T10.2 13.54,13.96 v14.5,13 | U1.8 2.12,12.48 2.1,12.29 | 2.1,12.29 1.91,12.27 | v1.93,12.09 2.1,12.29 | T7.2 3.03,6.75 v2.83,6.95
  pour Route15 (rank 3): 145,106 arc-90 146,105 146,2 arc-90 145,1 12,1.5 arc-90 16,5.5 16,97.5 arc-90 12,106
  pour Route15 (rank 4): 0.5,60 3,60 3,19 1,19 0.5,19
  pour Route15 (rank 4): 1,105.5 15.5,105.5 15.5,60 1,60
  pour Route15 (rank 4): 1,19 15,19 15,1 1,1
I2C1_SCL  (via drill 0.5)
  Top 0.254: v2.35,57.43 2.33,56.98 v3.14,55.5
  Bottom 0.254: TO_MAIN.2 2.33,42.98 1.9,43.41 1.9,52.89 3.25,54.24 | 3.25,54.24 4.02,55.01 U14.P$21 | USB_BRIDGE.5 5.47,67.25 R43.2 3.23,67.23 3,67 3,62.5 2.5,62 2.5,58 v2.35,57.43 | v3.14,55.5 3.81,54.79 3.25,54.24
I2C1_SDA  (via drill 0.5)
  Top 0.254: v4.49,63.21 4.5,54.01 v4.77,53.74
  Bottom 0.203: R44.2 5.56,71.94 9,68.5 9,65.75 8.5,65.25
  Bottom 0.254: TO_MAIN.19 6.02,42.98 5.5,43.5 5.46,45.85 4.11,45.85 2.45,46.79 2.45,52.6 4.23,54.51 5,54.51 | 5,54.51 U14.P$20 | USB_BRIDGE.4 8.5,65.25 7.25,65.25 v4.49,63.21 | v4.77,53.74 4.77,54.28 5,54.51
LED_PWM_1
  Bottom 0.203: R15.1 1.15,101.15 1,101 1,94 0.5,93.5 0.5,40 0.87,40 1.7,39.17 TO_MAIN.5
LED_PWM_2  (via drill 0.5)
  Top 0.254: v5.46,39.76 4.24,39.76 1.5,42.5 1.5,84 7,89.5 7,92 6.5,92.5 4,92.5 3,93.5 3,98.5 7.53,104.41 v13.5,104.41
  Bottom 0.254: TO_MAIN.16 6.05,39.17 v5.46,39.76 | v13.5,104.41 14.22,104.5 R16.1
LED_PWM_3
  Bottom 0.254: TO_MAIN.6 1.9,37.9 0.7,37.5 0.67,10.21 1.2,9.88 1.22,9.83 R84.1
LED_PWM_4  (via drill 0.5)
  Top 0.203: v6,105 4.5,105 2,102.5 2,90.5 v1.94,90
  Route2 0.203: v1.94,90 1.94,88.97 2.65,88.25 2.69,87.52 2,86.8 2,86.5 1,85.5 1,71 3.5,68.5 3.5,67.5 1.5,65.5 1.5,59.5 3,58 3.46,57.64 3.94,57.03 3.97,56.04 3.97,54.36 3.5,54 2.5,54 1.5,53 1.4,45.7 4,43.5 4.5,43.5 6.5,41.5 6.5,38 v5.5,37
  Bottom 0.203: R86.1 139.39,95.11 137,97.5 137,104.5 135,106.5 7.5,106.5 v6,105 | v5.5,37 5.5,37.26 6.14,37.9 TO_MAIN.15
LED_PWM_5  (via drill 0.5)
  Top 0.254: v1.5,19 2.5,19 3.16,19.69 7.16,19.69 8.5,18 v12.81,18
  Bottom 0.203: v12.81,18 12.82,17.68 13.5,17 13.5,16.31 R87.1
  Bottom 0.254: TO_MAIN.7 1.49,36.64 1.29,36.5 1.29,19.5 v1.5,19 | 13.32,16.6 R87.1
LEFT_RX  (via drill 0.5)
  Route15 0.254: v23,51 v16.3,51
  Bottom 0.254: R41.2 v16.3,51
  pour Top: 21,94.62 21,12.38 arc181 26,12.38 26,94.62 arc180
MGC3130_IRQ  (via drill 0.5)
  Top 0.254: v9.44,42.02 6.92,42.02 5.5,43 5.52,46.05 v4.96,46.64 6.5,48.18 v6.69,58
  Bottom 0.254: U14.P$12 8,50.23 7.38,49.61 5.98,49.61 5.22,48.56 R88.2 5,47.83 v4.96,46.64 | TO_MAIN.18 9.37,41.71 v9.44,42.02 | USB_BRIDGE.1 6.75,59.25 v6.69,58
MGC3130_RESET
  Bottom 0.203: USB_BRIDGE.6 10.56,69.5 11.5,69.5 11.5,60.5 10.5,59 9.5,59 8,57.5 8,57.13 | R45.2 5.15,57.35 5.5,57 8,57
  Bottom 0.254: U14.P$24 8,57 8,57.13 | TO_MAIN.3 2.79,41.71 1.37,42.58 1.34,55.61 2,56.5 5,56.5 5,57.25 R45.2
N$1
  Top 0.203: LED29.P$1 140.03,43.91 R66.2
N$2
  Top 0.203: LED21.P$1 10.62,63.38 10,64 10,64.71 R67.2
N$3
  Top 0.203: LED30.P$1 140.06,28.43 R68.2
N$4
  Top 0.203: LED22.P$1 12,79.5 11.1,79.92 R69.2
N$5
  Top 0.254: R70.2 101.57,1.2 102.4,1.2 102.95,1.75 LED31.P$1
N$6  (via drill 0.5, 0.6)
  Top 0.203: v120.5,1.54 120.15,1.74 LED15.P$2
  Top 0.254: 3.19,10.17 v2.88,10.48 5,8.36 5,4 3.56,2.56 v3.19,2.56
  Bottom 0.203: 4.6,0.8 5.3,0.5 120.15,0.6 v120.5,1.54
  Bottom 0.254: 4.6,0.8 4.6,1.15 v3.19,2.56 | v2.88,10.48 2.88,10.93 3.42,11.2 U1.6
N$7
  pour Route15 (hatched): 33,87.12 119,87.12 arc-90 121,85.12 121,21.88 arc-90 119,19.88 33,19.88 arc-90 31,21.88 31,85.12 arc-90
N$8
  Top 0.203: 48.02,105.1 LED23.P$1 48.77,105.12 49.2,104.7 49.2,104.2 49.4,104 50.36,104 R71.2
N$9
  Top 0.254: R72.2 81.14,1.3 82,1.3 82.45,1.75 LED32.P$1
N$10
  Top 0.203: 68.58,105.12 LED24.P$1 68.67,105.12 69,104.8 69,104.5 69.5,104 70.1,104 R73.2
N$11
  Top 0.254: R76.2 41.9,1.2 42.45,1.75 LED34.P$1
N$12
  Top 0.254: R74.2 61.9,1.2 62.45,1.75 LED33.P$1
N$13
  Top 0.254: LED25.P$1 88.03,105.1 89,105.1 90.25,103.85 R75.2
N$14
  Top 0.203: 108.03,105.1 108.9,105.1 109.4,104.5 110.03,103.87 R77.2
  Top 0.254: LED26.P$1 108.03,105.1
N$15
  Top 0.254: R78.2 11.89,32.27 LED35.P$1
N$16
  Top 0.203: LED27.P$1 140.03,74.59 R79.2
N$17
  Bottom 0.203: T5.3 3.19,105.81 3,106 1.5,106 1,105.5 1,104 1.5,103.5 2,103.5 2.79,102.71 R15.2
N$18
  Top 0.254: LED36.P$1 9.64,47.88 R80.2
N$19
  Top 0.203: LED28.P$1 140.01,59.36 R81.2
N$45
  Bottom 0.254: R38.1 12.5,57 11.84,56.41 11.91,54.04 11.55,53.5 U14.P$4
N$46
  Bottom 0.254: R39.1 13.15,54.15 13,53.9 12.6,53.9 11.84,53 U14.P$5
N$47
  Bottom 0.254: R40.1 12.5,52.76 12,52.5 U14.P$6
N$48
  Bottom 0.254: R41.1 12.5,51 11.5,52 U14.P$7
N$49
  Bottom 0.254: U14.P$8 10.39,51.05 12.44,49 R42.1
N$50
  Bottom 0.254: U14.P$9 9.5,50.4 10.39,49.62 10.88,49.62 11.5,49 11.5,46.49 C33.1
N$51  (via drill 0.5)
  Top 0.203: LED1.P$2 12.62,51.62 13.44,52.5 13.44,72.5 v12.74,72.89 | v2.88,86.55 4.5,88 4.5,90 v3.5,91
  Bottom 0.203: v12.74,72.89 12.5,73 3.5,82 3.5,86 v2.88,86.55 | v3.5,91 5,92.5 5.6,92.5 U2.15
N$52
  Bottom 0.254: U14.P$11 8.5,50 8,49.5 8,48.42 C34.1
N$53  (via drill 0.5)
  Top 0.203: LED2.P$2 11.38,67.12 7.5,71 v7.5,71.5
  Bottom 0.203: v7.5,71.5 7.5,77 1.01,83.88 1.01,92.88 3.5,95.99 4,95.99 4,96 5,95 5,94.26 U2.1
N$54  (via drill 0.5)
  Top 0.203: LED3.P$2 10.38,82.62 10,83 10,89.5 11.5,91 11.5,93 10.5,94 7.5,94 v4,97.5
  Bottom 0.203: v4,97.5 5.39,95.19 U2.2
N$55  (via drill 0.5)
  Top 0.203: v32.35,105.4 33.92,105.05 LED4.P$2
  Bottom 0.203: U2.3 6.18,95.82 5,97 5,98 4.5,98.5 4.5,100.5 4.49,101.49 6.94,104.44 8.5,106 12.5,106 13.01,105.97 31.26,105.97 v32.35,105.4
N$56  (via drill 0.5)
  Top 0.203: v52.4,104.55 52.6,104.55 53.15,105.1 53.98,105.1 LED5.P$2
  Route2 0.203: v52.4,104.55 52.17,103.8 51.93,103.8 15.99,103.68 15.5,104.5 15.5,105 15.04,105.3 v12.39,105.24
  Bottom 0.203: U2.4 6.67,96.01 5.5,97.5 5.5,98.5 5,99 5,101 5.55,101.94 5.6,102.03 8.6,105.24 v12.39,105.24
N$57  (via drill 0.5)
  Top 0.203: v72.33,103.88 72.29,104.52 73.2,105.2 73.92,105.2 LED6.P$2 | v12.18,95.94 8.06,95.94 v7,97
  Route2 0.203: v72.33,103.88 72.17,103.47 14.96,103.2 14.5,102 14.5,97.5 v12.18,95.94
  Bottom 0.203: U2.5 7.18,96.53 7,96.71 v7,97
N$58  (via drill 0.5)
  Top 0.203: v96.05,104.15 94.1,104.15 94,104.25 LED7.P$2
  Route2 0.203: v96.05,104.15 95.38,103.23 74.86,103.16 74.71,103.16 73.02,104.68 71.85,104.68 71.39,104.22 v65.97,104.22
  Bottom 0.203: v65.97,104.22 64.77,103.43 42.52,103.34 42,103.5 20.5,103.5 20,104 18.5,104 18,103.5 13,103.5 11.25,104.25 8.5,104.25 8.23,103.93 6.5,102 6.5,98.5 7,98 7.5,98 8,97.5 8,96 7.68,95.68 U2.6
N$59  (via drill 0.5)
  Top 0.203: v116.05,103.65 114.35,103.65 114,104 LED8.P$2
  Route2 0.203: v116.05,103.65 115.3,102.61 16.26,102.72 15.38,102.38 15,102 15,97 v13.5,95.5
  Bottom 0.203: U2.7 8.36,95 9,95 9.5,95.5 11,95.5 12,94.5 12.5,94.5 v13.5,95.5
N$60
  Top 0.254: R54.2 11.94,55.56 LED1.P$1
N$61
  Top 0.203: R55.2 10.45,71.55 11,71 11.88,71 LED2.P$1
N$62
  Top 0.203: LED3.P$1 12,87.5 12.5,88 13,88 R56.2
N$63
  Top 0.254: LED4.P$1 38.12,105 39,105 39.65,105.65 R57.2
N$64
  Top 0.203: LED5.P$1 58.24,105.37 R58.2
N$65
  Top 0.203: LED6.P$1 78.48,105.61 R59.2
N$66
  Top 0.254: LED7.P$1 98.03,105.1 98.9,105.1 99.4,105.6 R60.2
N$67
  Top 0.254: LED8.P$1 118.03,105.1 119,105.1 119.49,105.59 R61.2
N$68  (via drill 0.5)
  Top 0.203: v61.96,104.4 61.55,103.7 60.17,103.7 R58.1 | v41.85,105.2 41.1,103.95 R57.1 18.25,103.95 15.75,104.75 | R54.1 7.9,58.1 5,61 5,62 6,63 6.03,72.23 8,73 8.71,73 | 8.71,73 R55.1 | 15.75,104.75 14.5,106 3,106 v1.76,105.03 | 8.71,73 8.71,85.79 v8.5,86 | R56.1 11,89.1 11,89.5 12,90.5 v12.5,90.5 12.5,92.5 14.5,94.5 14.5,102.5 15.5,103.5 15.5,104.5 15.75,104.75
  Bottom 0.203: v61.96,104.4 61.2,104.6 59.65,105.6 50.28,105.61 49.15,104.65 48.55,103.82 43.08,103.8 v41.85,105.2 | v1.76,105.03 3.26,105 T5.1 | v8.5,86 8.5,86.5 v12.5,90.5
N$69  (via drill 0.5)
  Top 0.203: R59.1 81.05,103.9 82,103.9 | 82,103.9 83.1,102.8 99.2,102.8 100.3,103.9 R60.1 102.1,103.9 103,102.75 118.1,102.75 118.99,103.89 R61.1 | v82.15,104.85 82.15,104.05 82,103.9 | 13,42 14,43 14,45.5 15,46.5 15,90.5 v14.5,91
  Top 0.254: R47.1 7.9,25.4 8.5,26 12.5,26 13.5,27 13.5,41.5 13,42 11.5,42 10.11,40.11 8.11,40.11 8,40.16 R46.1
  Bottom 0.203: v82.15,104.85 81.55,105.55 80.2,105.55 79.65,105.89 71.72,105.87 70.3,102.9 20.1,102.89 19.64,103.31 T6.1 18.83,102.95 15.7,102.95 15.65,103 15,103 14.5,102.5 v14.5,91
N$70  (via drill 0.5)
  Top 0.254: LED9.P$2 12,35 v12.5,34.5
  Bottom 0.254: v12.5,34.5 12.5,34 13.5,33 13.5,20.5 10.5,17.5 10.5,17 8,14.5 5.4,14.5 U1.15
N$71  (via drill 0.5)
  Top 0.254: v10,12.5 14.5,17 14.5,19 13,20.5 12.12,20.5 LED10.P$2
  Bottom 0.254: U1.1 6.24,13.16 7,12 9.5,12 v10,12.5
N$72  (via drill 0.5)
  Top 0.203: v36.4,3.1 36.9,2.6 36.9,2.1 37.25,1.75 LED11.P$2
  Bottom 0.203: 6.02,4.12 7.64,2.68 35.9,2.64 36.2,3.1 v36.4,3.1
  Bottom 0.254: 6.02,4.12 6.02,11.27 U1.2
N$73  (via drill 0.6)
  Top 0.203: v56.2,2.8 57,2 57,1.8 57.05,1.75 LED12.P$2
  Bottom 0.203: 5.26,3.95 7.41,2.14 56.01,2.14 56.2,2.5 v56.2,2.8
  Bottom 0.254: 5.26,3.95 5.26,10.51 4.95,11.1 U1.3
N$74  (via drill 0.6)
  Top 0.203: v76,2.5 76.95,1.75 LED13.P$2
  Bottom 0.203: 4.67,3.82 6.05,1.45 75.55,1.5 v76,2.5
  Bottom 0.254: 4.67,3.82 4.67,10.06 4.39,10.55 4.42,12.07 U1.4
N$75  (via drill 0.6)
  Top 0.203: v100,1.9 99.85,1.75 LED14.P$2
  Bottom 0.203: 3.91,4.1 5.4,0.93 99.8,1.03 100,1.6 v100,1.9
  Bottom 0.254: 3.91,4.1 3.91,9.76 3.9,10.04 3.89,12.08 U1.5
N$77  (via drill 0.5)
  Top 0.203: v143,25 140.38,25 LED16.P$2
  Route2 0.203: v143,25 145.5,25 146,24.5 146,1.5 145,0.5 3.5,0.5 2,2 2,8.5 v2.5,9
  Bottom 0.203: v2.5,9 2.5,9.5
  Bottom 0.254: U1.7 2.76,11.46 2,11 2,10 2.5,9.5
N$78
  Top 0.203: LED9.P$1 10.71,39.12 R46.2
N$79
  Top 0.254: LED10.P$1 9.62,24.62 R47.2
N$80
  Top 0.254: R48.2 31.23,1.2 32.1,1.2 32.65,1.75 LED11.P$1
N$81
  Top 0.254: R49.2 51.09,1.1 52,1.1 52.65,1.75 LED12.P$1
N$82
  Top 0.203: 71.9,1.3 72.7,1.3 73.15,1.75 LED13.P$1
  Top 0.254: R50.2 71.9,1.3
N$83
  Top 0.254: R51.2 92.2,1.2 92.75,1.75 LED14.P$1
N$84
  Top 0.254: R52.2 111.42,1.2 112.3,1.2 112.85,1.75 LED15.P$1
N$85
  Top 0.203: LED16.P$1 R53.2
N$87  (via drill 0.5)
  Top 0.203: R52.1 111.38,2.9 110.05,2.9 v109.7,3.25 | R51.1 91.29,3 v90,3 | 7.5,1.8 12.6,1.8 13.73,2.93 R48.1 32.23,2.93 v32.8,3.5 33.1,3.9 41.8,3.9 42.3,3.3 v42.3,3.15 42.7,2.9 43.5,4 49.3,4 50.1,2.9 50.99,2.9 R49.1 51.11,2.9 52.2,2.9 v52.4,3.1 | v70.15,2.9 71.7,2.65 R50.1
  Top 0.254: 7.5,1.8 4.8,1.8 4,1 2.5,1 v0.99,1.76
  Route2 0.203: v52.4,3.1 52.4,3.15 53.2,3.95 58,3.95 59.8,2.15 61.9,2.15 63.85,4.1 68.75,4.1 v70.15,2.9 71.05,3.8 89.1,3.8 89.9,3 v90,3 91,4 107.5,4 108.25,3.25 v109.7,3.25
  Bottom 0.254: v0.99,1.76 2,3 2,3.66 T7.1
N$88  (via drill 0.6)
  Top 0.203: v144.8,17.5 144.3,17 139.5,17 138.6,18 138.6,39.5 139.12,40.12 LED17.P$2
  Bottom 0.203: U3.15 143.69,17.5 v144.8,17.5
N$89  (via drill 0.6)
  Top 0.203: v145.01,15.1 144.1,16.15 138.4,16.15 138.05,16.3 138.05,54.55 139.22,55.62 LED18.P$2
  Bottom 0.203: U3.1 144.9,15.29 v145.01,15.1
N$90  (via drill 0.6)
  Top 0.203: v144.5,14 144,14.3 139,14.3 137.4,15.7 137.4,36.1 137.5,49.2 137.5,69.7 139.22,71.12 LED19.P$2
  Bottom 0.203: U3.2 144.5,14.09 v144.5,14
N$91  (via drill 0.6)
  Top 0.203: v142.5,13.4 137.5,13.4 136.9,13.9 136.9,84.9 137.72,85.68 138,85.7 138.93,86.62 LED20.P$2
  Bottom 0.203: U3.3 143.2,14.89 143.2,14.1 v142.5,13.4
N$92  (via drill 0.5)
  Top 0.203: R68.1 142.83,30.3 143.6,30.3 146,32.7 146,44.2 144.6,45.6 | 144.6,45.6 144.59,45.61 R66.1 144.6,45.6 | 144.6,45.6 146,47 146,60.1 144.54,61.06 | 144.54,61.06 R81.1 | v39.4,3 40.88,3 R76.1 | R74.1 61.9,2.9 62.9,3.9 79.8,3.9 80.68,3.02 R72.1 81.14,3 82,3 82.8,3.8 100.3,3.8 101.15,2.95 R70.1 | R74.1 | R74.1 60.4,2.9 60.4,3 v59.8,3.6 | 51.4,103.2 51.1,102.93 16.26,102.96 15.75,102.75 15,102 15,93 13.5,91.5 13.5,90.5 14.5,89.5 14.5,81.5 14,81 12.92,81 R69.1 13.62,80.88 14.5,80 14.5,65.73 v14.22,65.42 14.5,65.11 14.5,51.5 12.5,49.5 8.5,49.5 7.9,48.9 R80.1 7.9,47.6 9,46.5 9,43.21 9.34,42.81 10.13,42.81 10.5,42.5 10.5,42 10,40.91 7.5,40.91 6.5,40.5 6.5,38 10.5,36 10.5,34.5 9.5,33.5 9,33.5 8.5,33 8.5,32.37 R78.1 8.4,27.4 6.5,25.5 6.5,24 11.5,19 13.5,19 14,18.5 14,17.5 13,16.5 12,16.5 v9.5,14 | 51.4,103.2 51.4,104.48 R71.1 | 51.4,103.2 51.4,103.1 51.5,103 71.05,103 71.35,103.3 | 71.35,103.3 71.35,105.15 71,105.5 70.3,105.5 R73.1 | 71.35,103.3 71.35,103.25 71.65,102.95 74.8,102.95 v76,104.15 | v92.1,105.45 90.27,105.45 R75.1 | R77.1 111.93,105.57 v112,105.5 | v134.5,104 136,104 137,103 137,99 138,98 138,95 144.5,88.5 144.5,83.5 145.8,82.3 145.8,75.5 | 145.8,75.5 144.8,76.3 R79.1 | 144.54,61.06 144.54,67.04 145.8,67.85 145.8,75.5 | v12.44,65.19 11.47,65.2 10.5,66.5 10.01,66.5 R67.1
  Bottom 0.203: v59.8,3.6 58.3,3.6 58,4 40.3,4.1 v39.4,3 37.9,3 36.75,4.27 32.15,4.27 31.45,4.3 15.51,4.27 14.99,5.48 14.99,9.51 12.5,12 12.5,12.83 T10.1 12.48,13 11,13 10,14 v9.5,14 | v76,104.15 81.15,104.15 81.55,103.75 84.2,103.75 85.75,105.3 91.95,105.3 v92.1,105.45 92.15,105.5 v112,105.5 112.65,105.5 112.95,105.8 132.7,105.8 v134.5,104 | v14.22,65.42 12.8,65.42 v12.44,65.19
N$93  (via drill 0.5)
  Route2 0.203: v8,16 8,16.5 7,17.5 6.5,17.5 3,21 2,21 0.5,22.5 0.49,86.92 v1.86,87.82
  Bottom 0.203: U1.14 4.92,15.41 5.22,15.71 5.82,15.68 6.29,15.21 7.21,15.21 v8,16 | U2.9 9,93.36 9,90.5 8.31,87.48 3.31,87.48 2.97,87.82 v1.86,87.82
N$96
  Top 0.203: LED17.P$1 140.06,36.07 R62.2
N$97
  Top 0.203: LED18.P$1 140.04,51.58 R63.2
N$98
  Top 0.203: LED19.P$1 140.01,67.14 R64.2
N$99
  Top 0.203: LED20.P$1 140.03,82.65 R65.2
N$104  (via drill 0.5, 0.6)
  Top 0.203: v142.5,89 142.71,88.79 R65.1 144.7,82.36 v144.7,77.3 | v144.6,68.9 144.54,68.84 R64.1 | v144.5,54.5 143.88,54.5 R63.1 144.5,51.44 v144.5,47.5 | v144.5,37.8 144.47,37.77 R62.1 | R53.1 144.33,22.33 v144.5,22.5
  Bottom 0.203: T9.1 142.5,90.2 v142.5,89 | v144.7,77.3 144.7,74.7 144.6,74.6 v144.6,68.9 144.6,54.6 v144.5,54.5 | v144.5,47.5 v144.5,37.8 v144.5,22.5
N$115  (via drill 0.5, 0.6)
  Route15 0.203: 2.66,1.9 3.99,0.98 11.04,1.05 11.2,0.74 104.06,0.99 104.25,0.84 119.69,0.71 123.03,0.71 123.12,0.8 129.16,0.77 129.43,0.84 130.83,0.84 131.63,0.77 145.03,0.77 146,2 145.98,17.98 144.23,18.97 v144.2,18.9
  Route15 0.254: 2.66,1.9 2.52,1.98 0.61,3 0.61,13.45 v1.51,14.75
  Bottom 0.203: v144.2,18.9 143.8,18.5 143.5,18.5 143.17,18.17 U3.14
  Bottom 0.254: v1.51,14.75 1.49,13.98 1.66,13.66 U1.9
N$118
  Bottom 0.203: R16.2 16.38,105.2 17.1,105.2 17.74,105.23 T6.3
N$120
  Bottom 0.254: T7.3 1.1,7.49 R84.2
N$121
  Bottom 0.203: R86.2 141.12,93.45 T9.3
N$122
  Bottom 0.203: T10.3 11.61,16.12 R87.2
RIGHT_RX  (via drill 0.5)
  Route15 0.254: v127,55 v16.4,55
  Bottom 0.254: R39.2 v16.4,55
  pour Top: 126,94.62 126,12.38 arc181 131,12.38 131,94.62 arc180
SR_CLK  (via drill 0.5, 0.6)
  Top 0.203: v7.5,88.5 7,88.5 2,83.5 2,68.5 v2.5,68
  Top 0.254: v9.5,35 9,35 5,31 5,22.5 v2.42,20.17
  Route2 0.203: v2.5,68 2.5,67.5 1,66 0.93,45.34 v5.5,41.23
  Route15 0.203: 6.2,2.6 7.3,2.03 10.9,1.7 11.03,1.69 78.93,1.37 79.1,2 79.1,2.6 79.4,2.9 80.3,2.9 81.1,2.1 81.1,1.8 81.2,1.8 98.44,1.84 98.71,1.97 99.06,2.52 99.36,2.82 100.62,2.84 101.2,1.8 101.9,1.8 102,1.75 119.2,1.75 119.8,2.5 121.3,2.5 121.9,1.9 123.2,1.9 123.3,2 131,2 131.8,1.4 144.8,1.4 145.39,2.2 145.4,2.4 145.4,8.1 143.5,10 143.5,10.5 141.5,12.5 141.5,18.1 v142.2,18.8
  Route15 0.254: 6.2,2.6 4.4,2.6 3.5,3.5 1.5,3.5 1.07,4.02 1.07,13.02 2.5,14.5 2.5,15.5 v3,16.32
  Bottom 0.203: v142.2,18.8 142.17,18.77 U3.12 U3.11 | U2.12 U2.11 7.68,91.98 7.17,91.47 7.17,88.83 v7.5,88.5 | v5.5,41.23 5.5,41 6,40.5 7.39,40.5 TO_MAIN.17
  Bottom 0.254: TO_MAIN.17 9.56,40.44 10,40 10,35.5 v9.5,35 | v2.42,20.17 3.43,20.17 4.5,19 4.5,16.94 4.05,16.6 3.9,15.68 | 3.9,15.68 3.9,14.73 U1.12 U1.11 | v3,16.32 3.5,16 3.9,15.68
SR_DATA  (via drill 0.5)
  Top 0.203: v3.46,89.03 3.46,88.38 1,85.81
  Top 0.254: v1.5,41 1,41.5 1,85.81
  Bottom 0.203: 6.16,92.56 6.16,91.66 5.5,91 5,91 v3.46,89.03
  Bottom 0.254: TO_MAIN.4 2.06,40.44 v1.5,41 | 6.16,92.56 U2.14
TOP_RX  (via drill 0.5)
  Route15 0.254: v29.5,93 29.5,62.5 23,57 v16.36,57
  Bottom 0.254: R38.2 v16.36,57
  pour Top: 30.5,97.12 121.5,97.12 arc-180 121.5,92.12 30.5,92.12 arc-180
TX  (via drill 0.5)
  Bottom 0.254: v16.32,58.5 14.5,58.5 14,58.27 9.54,58.27 8.5,57.18 U14.P$25
  pour Route15 (rank 2, hatched): 17,102 135,102 arc-90 136,101 136,6 arc-90 135,4.88 17,4.88 arc-90 16,6 16,101 arc-90